# EAGLE design bristol_longshot (EAGLE 7.3.0)
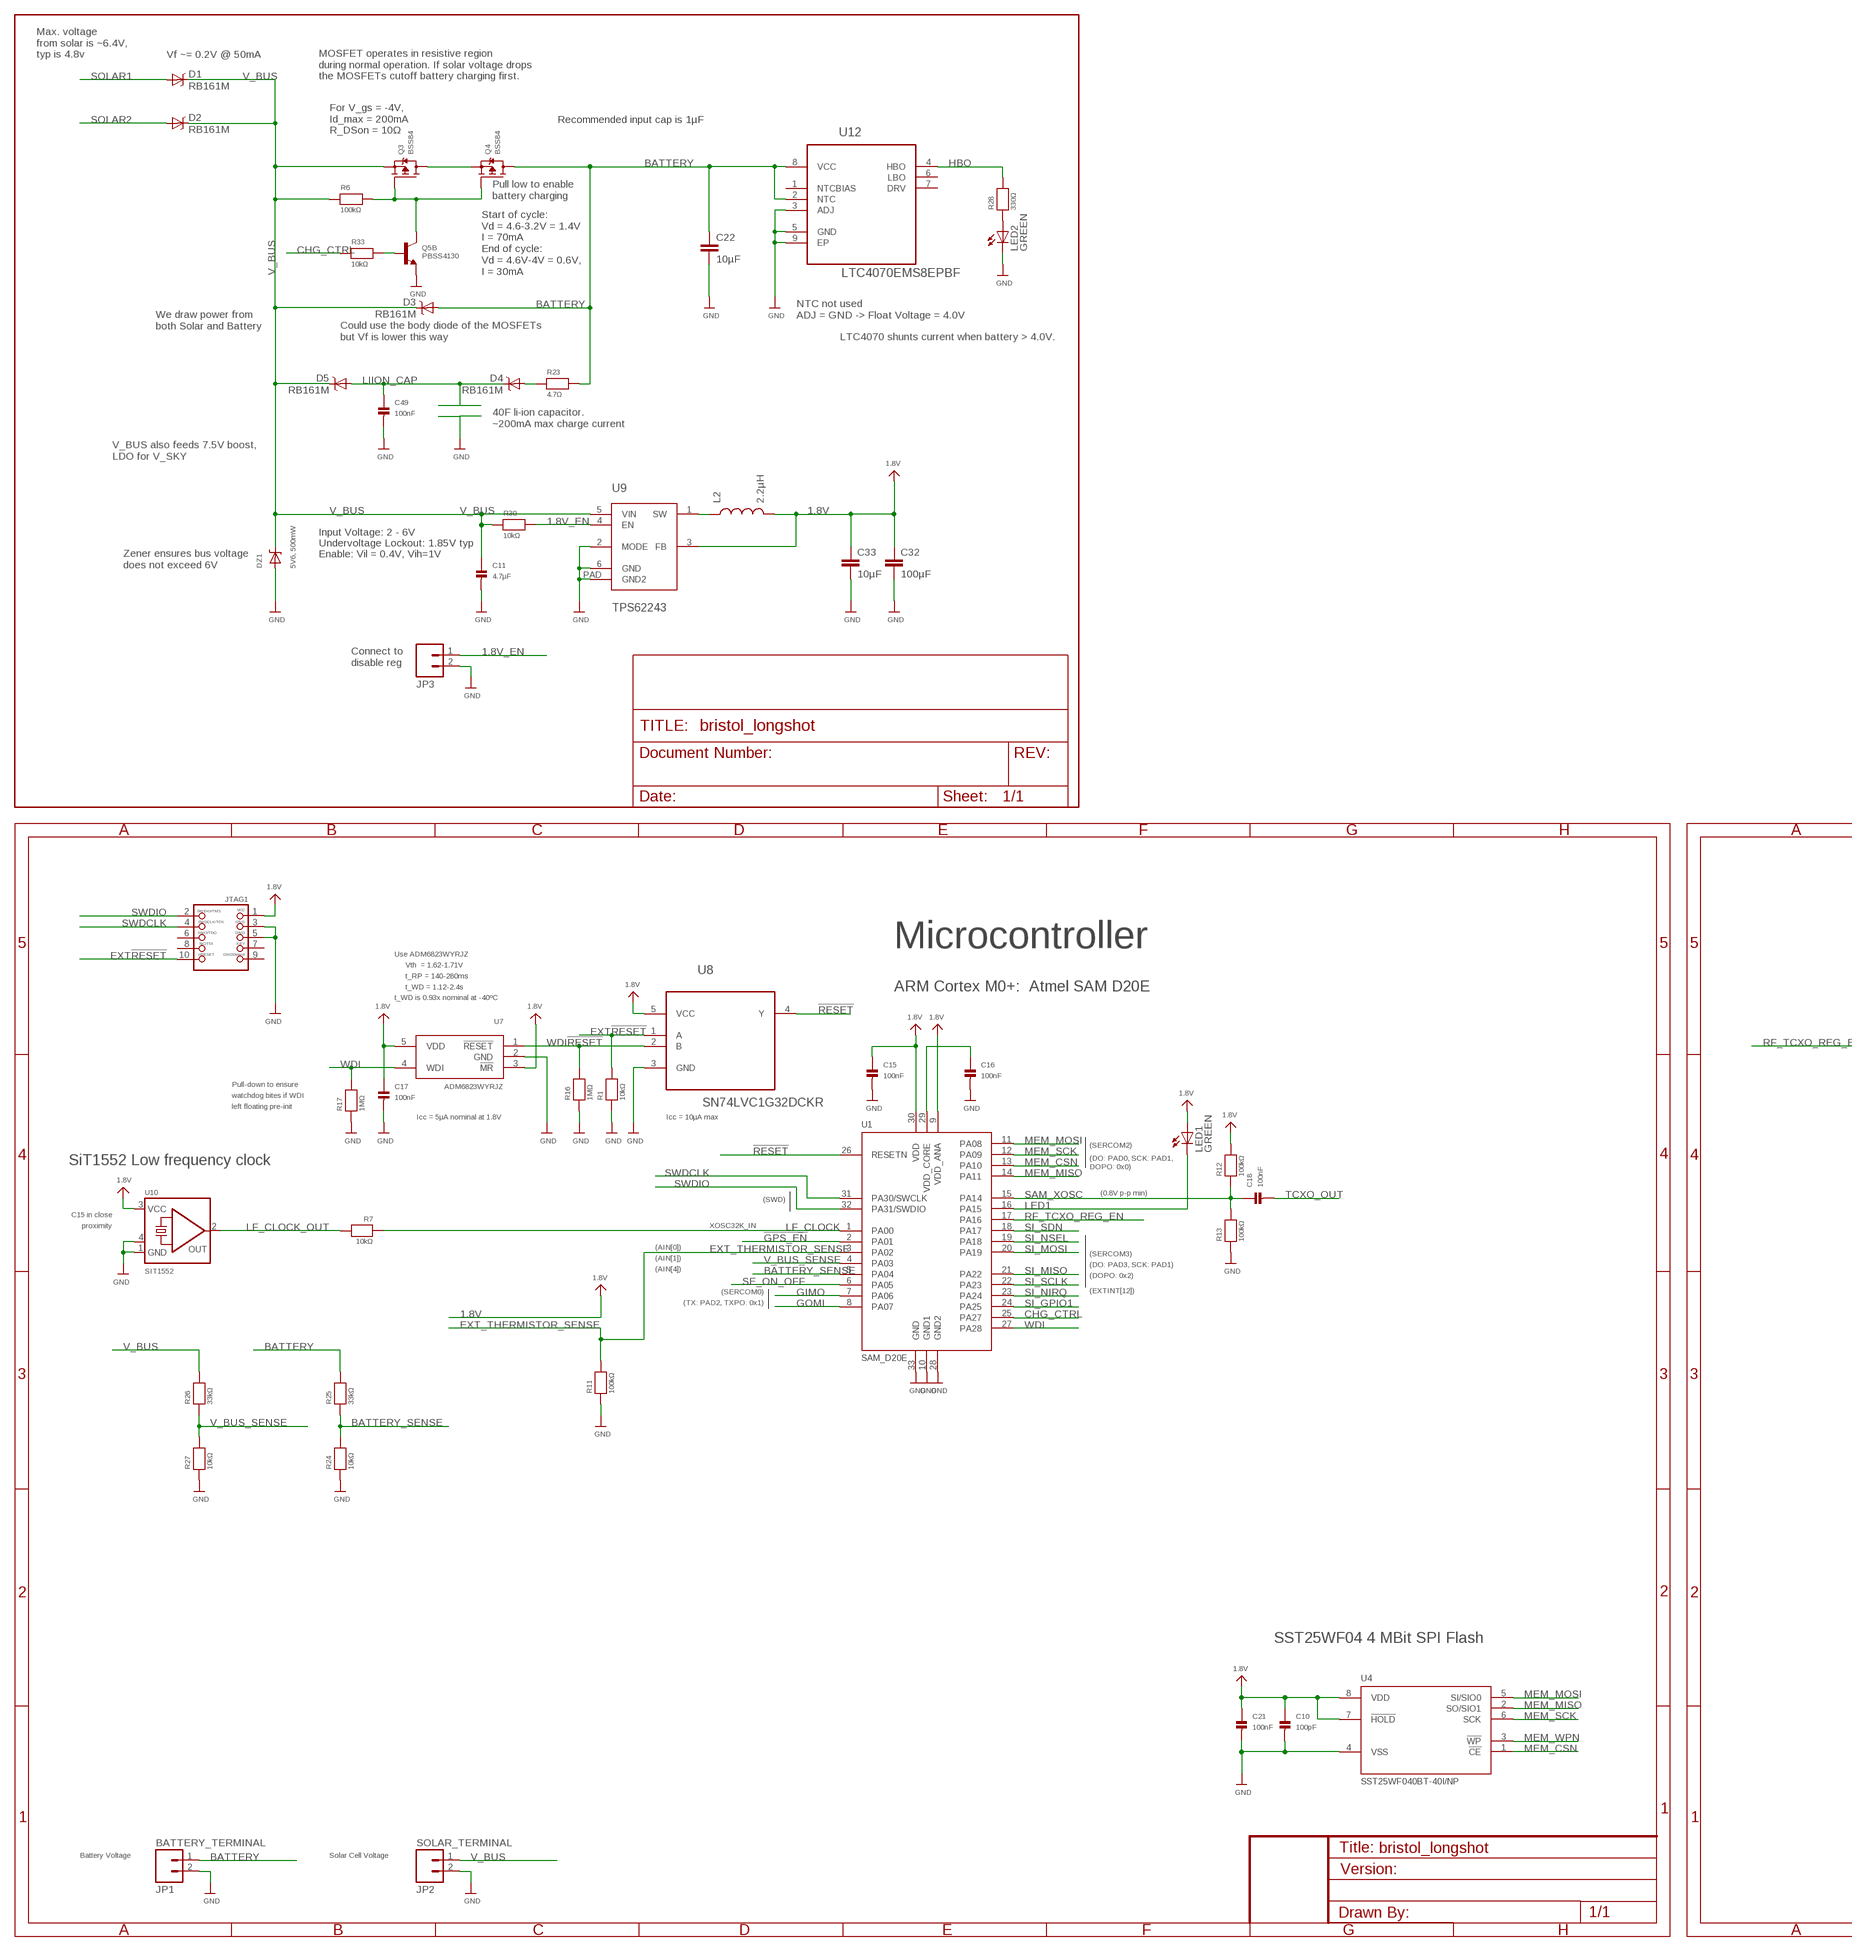
[diagram p0: schematic, sheet 1, part 1 of 3]
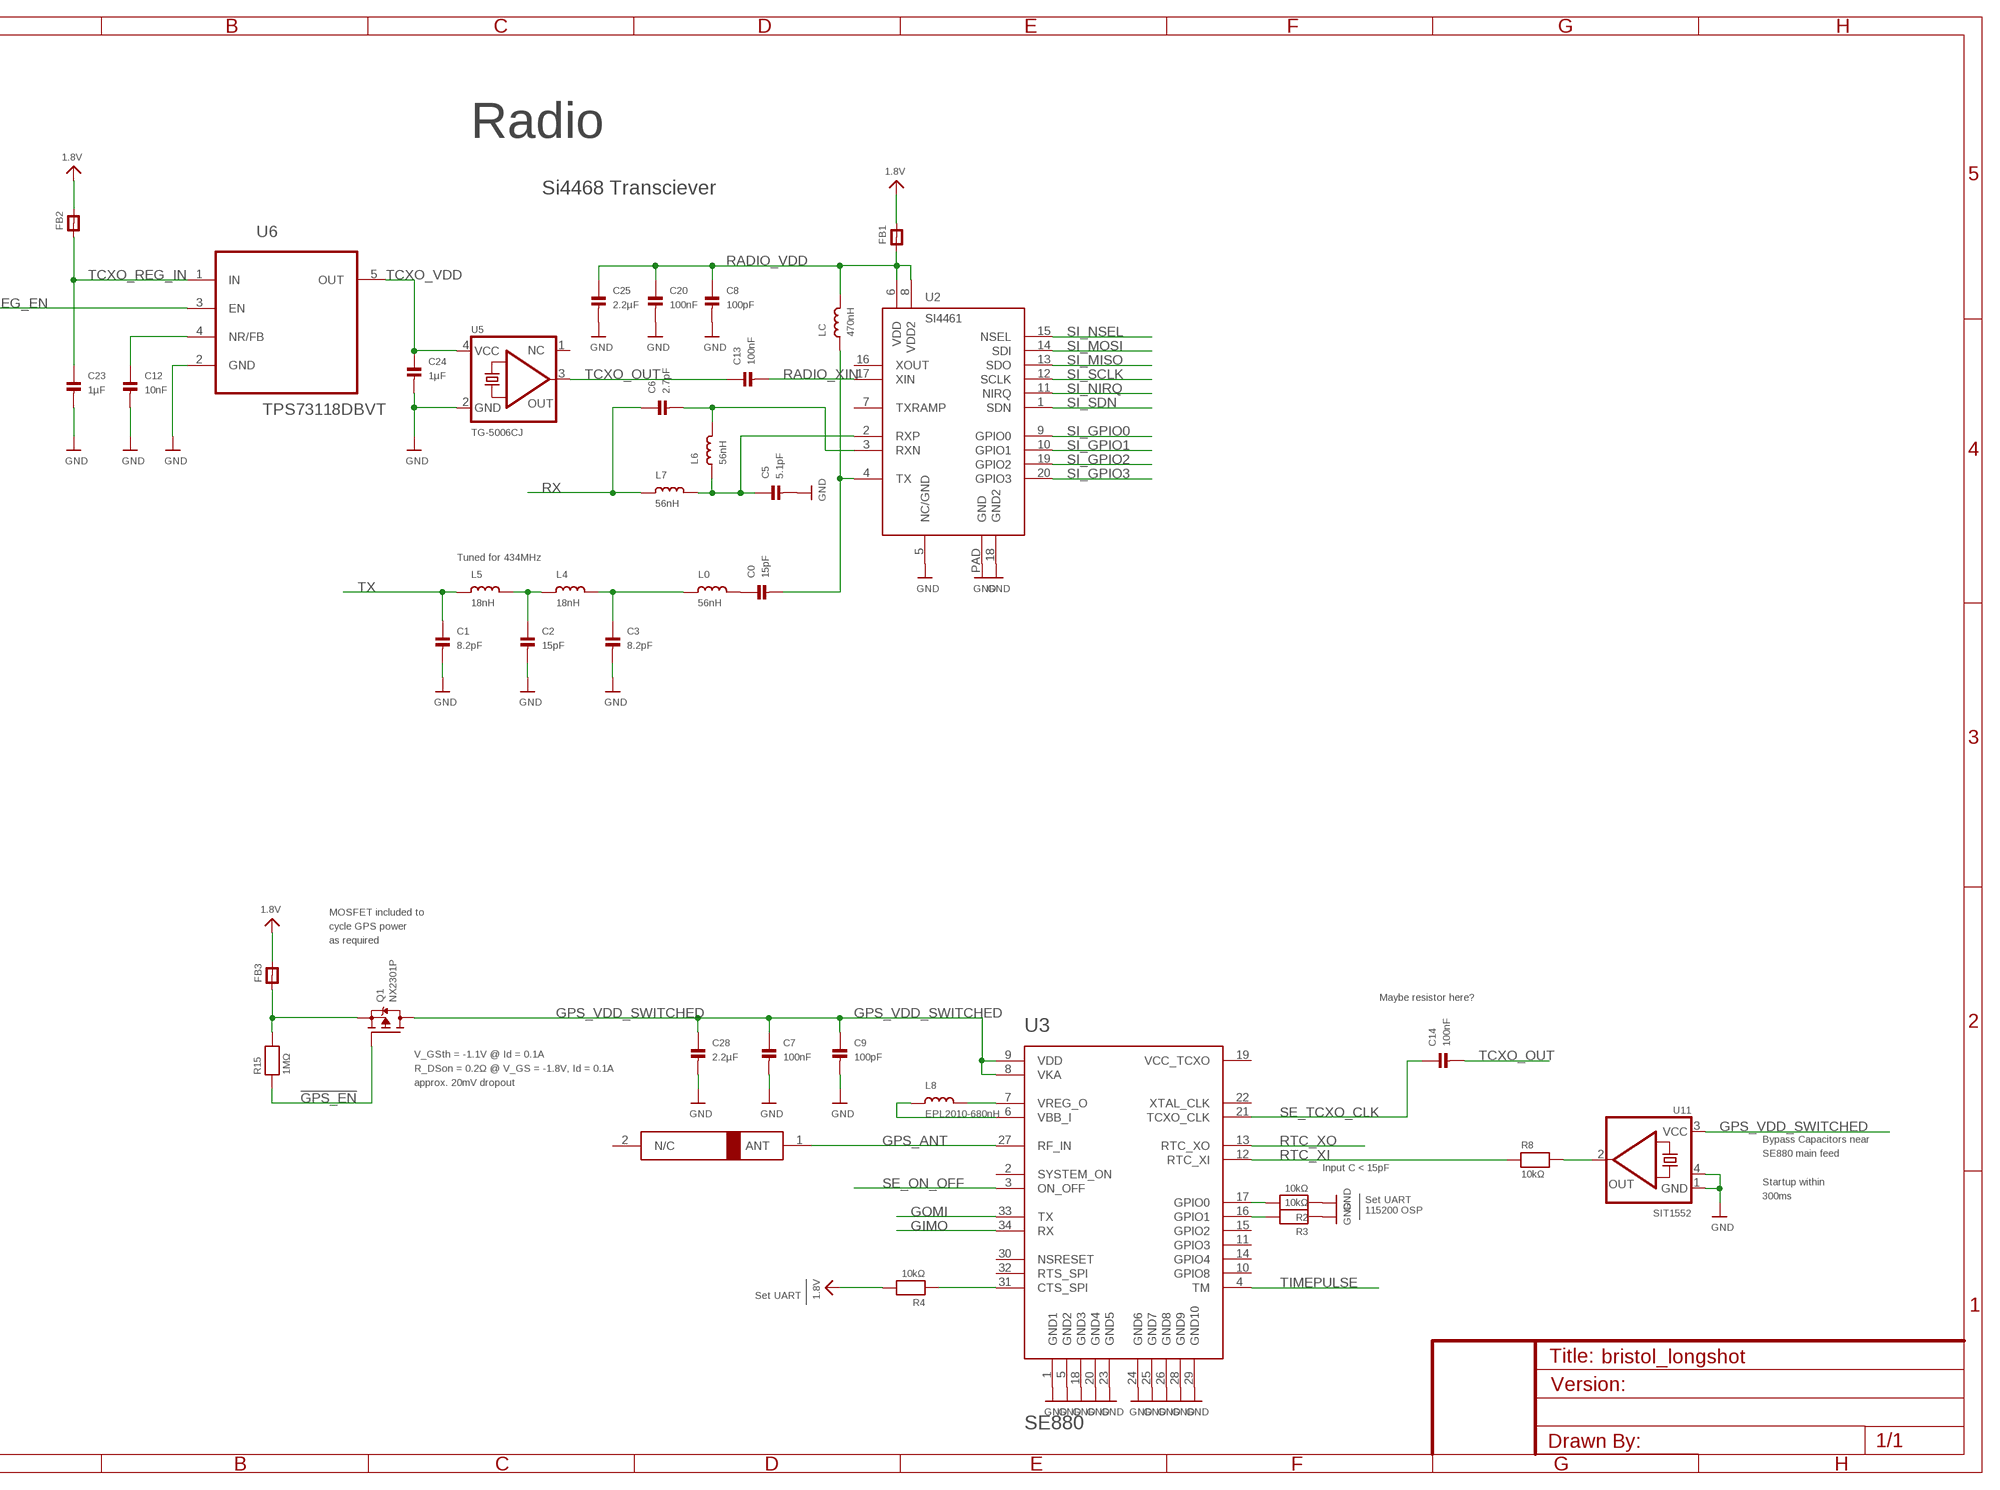
[diagram p1: schematic, sheet 1, part 2 of 3]
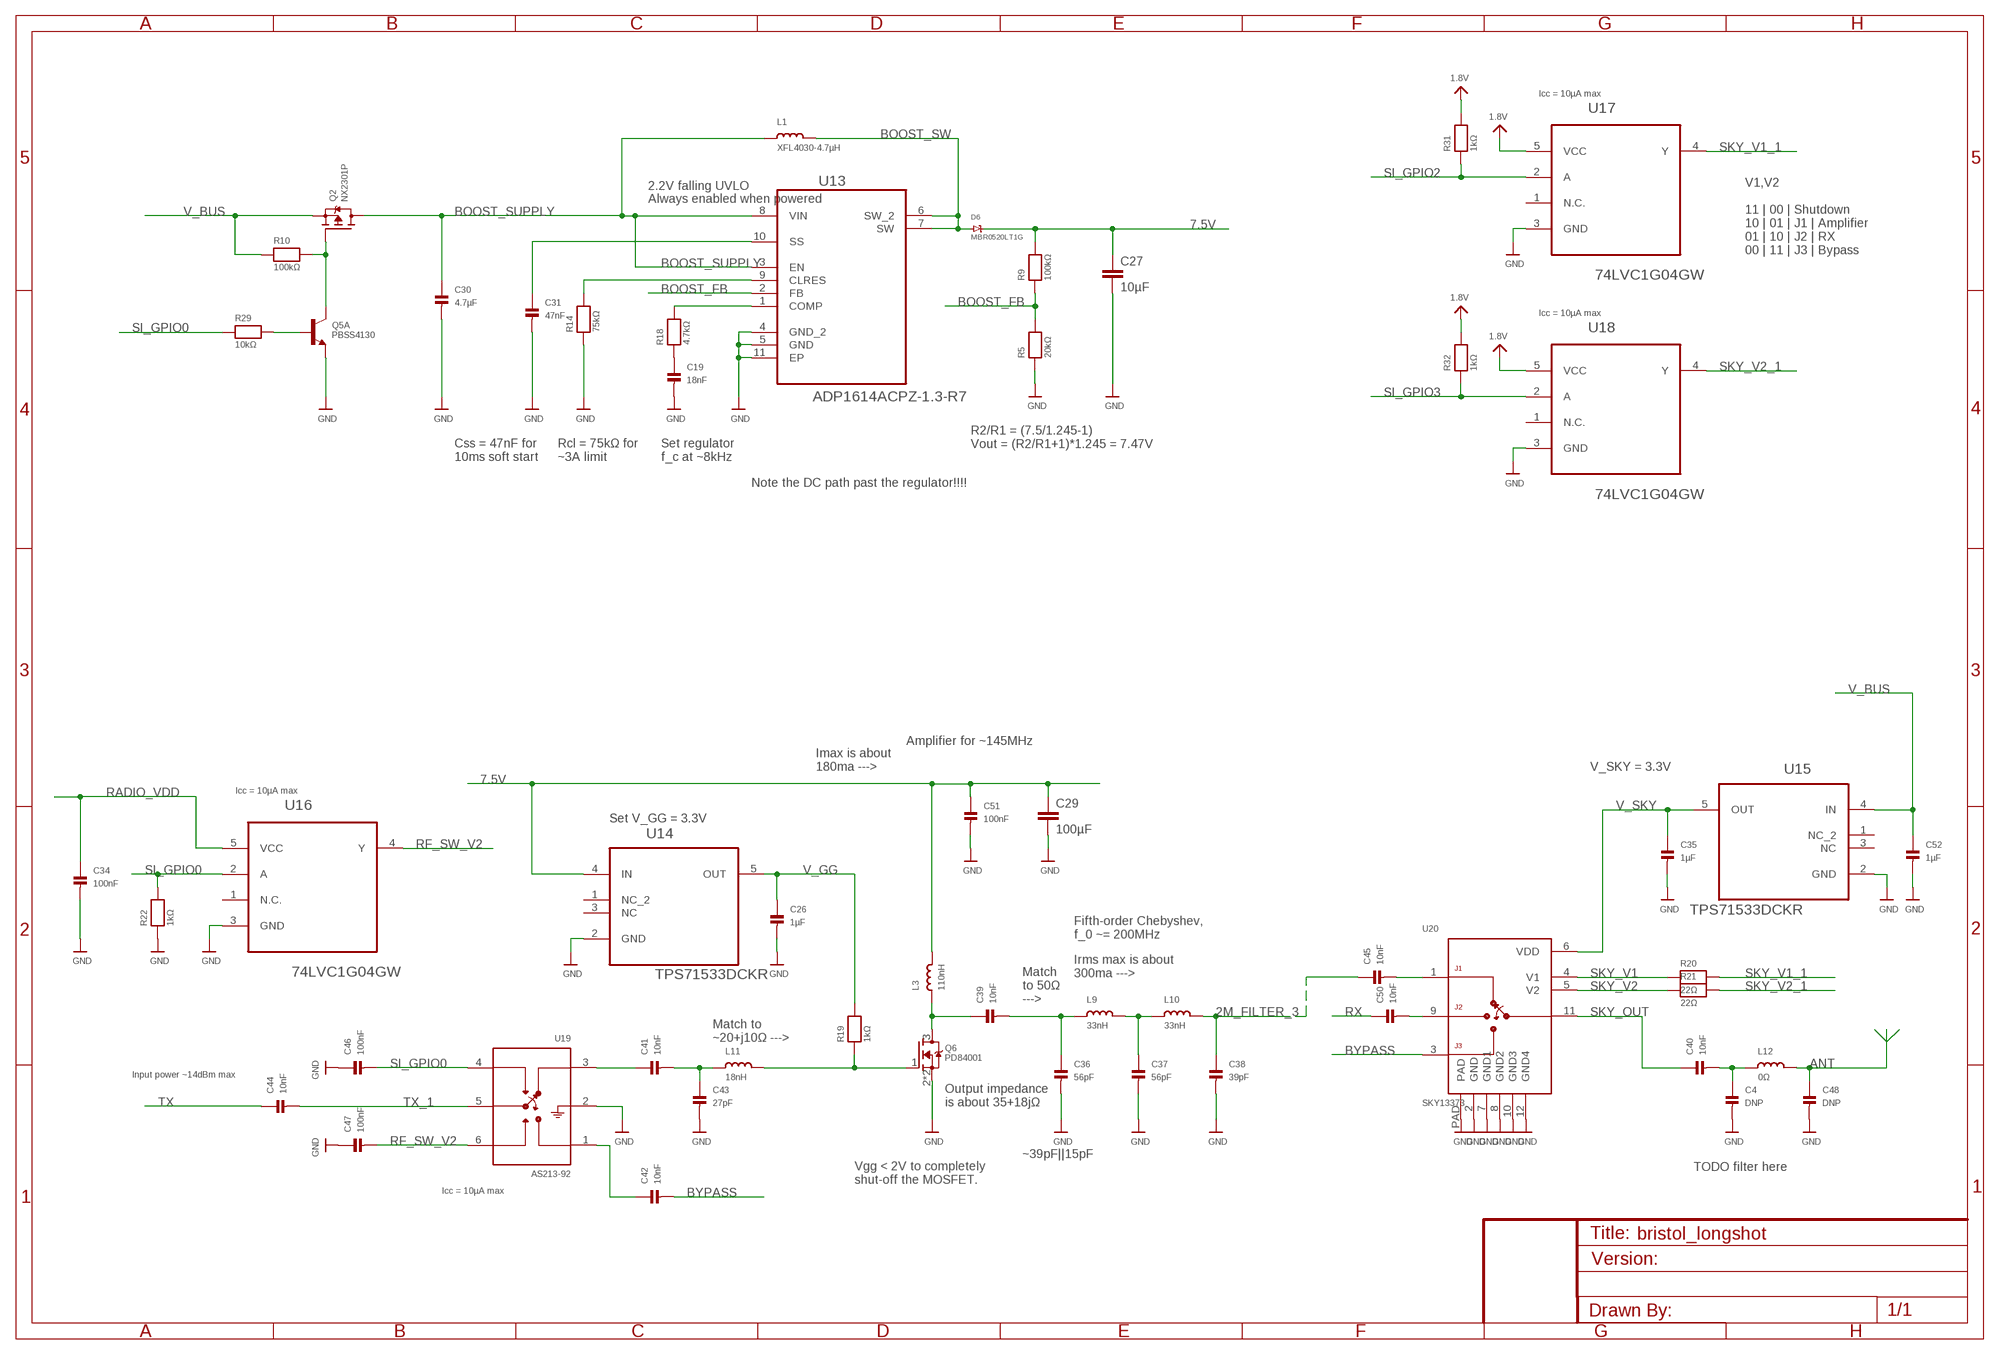
[diagram p2: schematic, sheet 1, part 3 of 3]

## Parts
A1  1575AT43A40  [1575AT43A40]
C0  15pF  CAP_CERAMIC_0402  [_0402]
C1  8.2pF  CAP_CERAMIC_0402  [_0402]
C2  15pF  CAP_CERAMIC_0402  [_0402]
C3  8.2pF  CAP_CERAMIC_0402  [_0402]
C4  DNP  CAP_CERAMIC_0402  [_0402]
C5  5.1pF  CAP_CERAMIC_0402  [_0402]
C6  2.7pF  CAP_CERAMIC_0402  [_0402]
C7  100nF  CAP_CERAMIC_0402  [_0402]
C8  100pF  CAP_CERAMIC_0402  [_0402]
C9  100pF  CAP_CERAMIC_0402  [_0402]
C10  100pF  CAP_CERAMIC_0402  [_0402]
C11  4.7µF  CAP_CERAMIC_0402  [_0402]
C12  10nF  CAP_CERAMIC_0402  [_0402]
C13  100nF  CAP_CERAMIC_0402  [_0402]
C14  100nF  CAP_CERAMIC_0402  [_0402]
C15  100nF  CAP_CERAMIC_0402  [_0402]
C16  100nF  CAP_CERAMIC_0402  [_0402]
C17  100nF  CAP_CERAMIC_0402  [_0402]
C18  100nF  CAP_CERAMIC_0402  [_0402]
C19  18nF  CAP_CERAMIC_0402  [_0402]
C20  100nF  CAP_CERAMIC_0402  [_0402]
C21  100nF  CAP_CERAMIC_0402  [_0402]
C22  10µF  C-EUC0603K  [C0603K]
C23  1µF  CAP_CERAMIC_0402  [_0402]
C24  1µF  CAP_CERAMIC_0402  [_0402]
C25  2.2µF  CAP_CERAMIC_0402  [_0402]
C26  1µF  CAP_CERAMIC_0402  [_0402]
C27  10µF  C-EUC0603K  [C0603K]
C28  2.2µF  CAP_CERAMIC_0402  [_0402]
C29  100µF  C-EUC1206K  [C1206K]
C30  4.7µF  CAP_CERAMIC_0402  [_0402]
C31  47nF  CAP_CERAMIC_0402  [_0402]
C32  100µF  C-EUC1206K  [C1206K]
C33  10µF  C-EUC0603K  [C0603K]
C34  100nF  CAP_CERAMIC_0402  [_0402]
C35  1µF  CAP_CERAMIC_0402  [_0402]
C36  56pF  CAP_CERAMIC_0402  [_0402]
C37  56pF  CAP_CERAMIC_0402  [_0402]
C38  39pF  CAP_CERAMIC_0402  [_0402]
C39  10nF  CAP_CERAMIC_0402  [_0402]
C40  10nF  CAP_CERAMIC_0402  [_0402]
C41  10nF  CAP_CERAMIC_0402  [_0402]
C42  10nF  CAP_CERAMIC_0402  [_0402]
C43  27pF  CAP_CERAMIC_0402  [_0402]
C44  10nF  CAP_CERAMIC_0402  [_0402]
C45  10nF  CAP_CERAMIC_0402  [_0402]
C46  100nF  CAP_CERAMIC_0402  [_0402]
C47  100nF  CAP_CERAMIC_0402  [_0402]
C48  DNP  CAP_CERAMIC_0402  [_0402]
C49  100nF  CAP_CERAMIC_0402  [_0402]
C50  10nF  CAP_CERAMIC_0805  [_0805]
C51  100nF  CAP_CERAMIC_0402  [_0402]
C52  1µF  CAP_CERAMIC_0402  [_0402]
D1  RB161M  [RB161M]
D2  RB161M  [RB161M]
D3  RB161M  [RB161M]
D4  RB161M  [RB161M]
D5  RB161M  [RB161M]
D6  MBR0520LT1G  DIODE[SCHOTKY]-SOD123W  [SOD123W]
DZ1  5V6, 500mW  DIODE-ZENERSOD  [SOD-323]
FB1  FERRITE_0402  [_0402]
FB2  FERRITE_0402  [_0402]
FB3  FERRITE_0603  [_0603]
JP1  BATTERY_TERMINAL  M02LOCK  [1X02_LOCK]
JP2  SOLAR_TERMINAL  M02LOCK  [1X02_LOCK]
JP3  M02LOCK  [1X02_LOCK]
JTAG1  JTAG-CORTEXM3SMT  [2X05_1.27MM_SMT]
L0  56nH  INDUCTOR_0402  [_0402@2]
L1  XFL4030-4.7µH  XFL4020  [XFL4020]
L2  2.2µH  INDUCTOR1007  [1007]
L3  110nH  INDUCTOR_0805MP  [_0805MP]
L4  18nH  INDUCTOR_0402  [_0402@2]
L5  18nH  INDUCTOR_0402  [_0402@2]
L6  56nH  INDUCTOR_0402  [_0402@2]
L7  56nH  INDUCTOR_0402  [_0402@2]
L8  EPL2010-680nH  EPL2010  [EPL2010]
L9  33nH  INDUCTOR_0603MP  [_0603MP]
L10  33nH  INDUCTOR_0603MP  [_0603MP]
L11  18nH  INDUCTOR_0402  [_0402@2]
L12  0Ω  INDUCTOR_0402  [_0402@2]
LC  470nH  INDUCTOR_0402  [_0402@2]
LED1  GREEN  LEDCHIPLED_0603  [CHIPLED_0603]
LED2  GREEN  LEDCHIPLED_0603  [CHIPLED_0603]
Q1  NX2301P  [SOT23]
Q2  NX2301P  [SOT23]
Q3  BSS84  NX2301P  [SOT23]
Q4  BSS84  NX2301P  [SOT23]
Q5  PBSS4130  [SOT1118]
Q6  PD84001  [SOT-89]
R1  10kΩ  RESISTOR_0402  [_0402]
R2  10kΩ  RESISTOR_0402  [_0402]
R3  10kΩ  RESISTOR_0402  [_0402]
R4  10kΩ  RESISTOR_0402  [_0402]
R5  20kΩ  RESISTOR_0402  [_0402]
R6  100kΩ  RESISTOR_0402  [_0402]
R7  10kΩ  RESISTOR_0402  [_0402]
R8  10kΩ  RESISTOR_0402  [_0402]
R9  100kΩ  RESISTOR_0402  [_0402]
R10  100kΩ  RESISTOR_0402  [_0402]
R11  100kΩ  RESISTOR_0402  [_0402]
R12  100kΩ  RESISTOR_0402  [_0402]
R13  100kΩ  RESISTOR_0402  [_0402]
R14  75kΩ  RESISTOR_0402  [_0402]
R15  1MΩ  RESISTOR_0402  [_0402]
R16  1MΩ  RESISTOR_0402  [_0402]
R17  1MΩ  RESISTOR_0402  [_0402]
R18  4.7kΩ  RESISTOR_0402  [_0402]
R19  1kΩ  RESISTOR_0402  [_0402]
R20  22Ω  RESISTOR_0603MP  [_0603MP]
R21  22Ω  RESISTOR_0603MP  [_0603MP]
R22  1kΩ  RESISTOR_0402  [_0402]
R23  4.7Ω  RESISTOR_0402  [_0402]
R24  10kΩ  RESISTOR_0402  [_0402]
R25  33kΩ  RESISTOR_0402  [_0402]
R26  33kΩ  RESISTOR_0402  [_0402]
R27  10kΩ  RESISTOR_0402  [_0402]
R28  330Ω  RESISTOR_0402  [_0402]
R29  10kΩ  RESISTOR_0402  [_0402]
R30  10kΩ  RESISTOR_0402  [_0402]
R31  1kΩ  RESISTOR_0402  [_0402]
R32  1kΩ  RESISTOR_0402  [_0402]
R33  10kΩ  RESISTOR_0402  [_0402]
U1  SAM_D20E  [QFN32_5MM]
U2  SI4461  SI4060  [QFN20]
U3  SE880  [SE880]
U4  SST25WF040BT-40I/NP  [USON-8]
U5  TG-5006CJ  [TC-5006CJ]
U6  TPS73118DBVT  [SOT95P280X145-5N]
U7  ADM6823WYRJZ  TPS3123  [SOT23-5]
U8  SN74LVC1G32DCKR  [SOT65P210X110-5N]
U9  TPS62243  [S-PWSON-N6]
U10  SIT1552  [SIT1552]
U11  SIT1552  [SIT1552]
U12  LTC4070EMS8EPBF  [SOP65P490X110-9N]
U13  ADP1614ACPZ-1.3-R7  [DFN50P300X300X80-11N]
U14  TPS71533DCKR  [SOT65P210X110-5N]
U15  TPS71533DCKR  [SOT65P210X110-5N]
U16  74LVC1G04GW  [SOT65P210X110-5N]
U17  74LVC1G04GW  [SOT65P210X110-5N]
U18  74LVC1G04GW  [SOT65P210X110-5N]
U19  AS213-92  [SOT-6]
U20  SKY13373  [SKY13373]

## Nets
1.8V: C10.1 C15.1 C17.1 C21.1 C32.1 C33.1 FB1.2 FB2.2 FB3.2 JTAG1.1 L2.2 LED1.A R4.2 R12.2 R31.2 R32.2 U1.9(VDD_ANA) U1.30(VDD) U4.7(!HOLD) U4.8(VDD) U7.3(!MR) U7.5(VDD) U8.5(VCC) U9.3(FB) U10.3(VCC) U17.5(VCC) U18.5(VCC)
1.8V_EN: JP3.1 R30.2 U9.4(EN)
2M_FILTER_1: C36.1 C39.2 L9.1
2M_FILTER_2: C37.1 L9.2 L10.1
2M_FILTER_3: C38.1 C45.1 L10.2
7.5V: C27.1 C29.1 C51.1 D6.P$2 L3.2 R9.2 U14.4(IN)
!GPS_EN: Q1.1(G) R15.1 U1.2(PA01)
!RESET: U1.26(RESETN) U8.4(Y)
AMPL_DRAIN: C39.1 L3.1 Q6.3(D)
AMPL_GATE: L11.2 Q6.1(G) R19.1
AMPL_IN: C41.2 C43.1 L11.1
AMPL_IN1: C41.1 U19.3(J2)
AMPL_OUT: C45.2 U20.1(J1)
ANT: C48.1 L12.2
ANT1: C4.1 C40.2 L12.1
BATTERY: C22.1 D3.ANODE(A) JP1.1 Q4.3(D) R23.2 R25.2 U12.2(NTC) U12.8(VCC)
BATTERY_MOSFET_1: Q3.3(D) Q4.2(S)
BATTERY_SENSE: R24.2 R25.1 U1.5(PA04)
BOOST_COMP: R18.2 U13.1(COMP)
BOOST_COMP_1: C19.1 R18.1
BOOST_CURRENTLIMIT: R14.2 U13.9(CLRES)
BOOST_FB: R5.2 R9.1 U13.2(FB)
BOOST_SOFTSTART: C31.1 U13.10(SS)
BOOST_SUPPLY: C30.1 L1.1 Q2.3(D) U13.3(EN) U13.8(VIN)
BOOST_SUPPLY_CTRL_B: Q5.P2(A:B) R29.2
BOOST_SUPPLY_CTRL_C: Q2.1(G) Q5.P3(A:C) Q5.P8(A:C) R10.2
BOOST_SW: D6.P$1 L1.2 U13.6(SW_2) U13.7(SW)
BUCK_SW: L2.1 U9.1(SW)
BYPASS: C42.2 U20.3(J3)
BYPASS1: C42.1 U19.1(J3)
CHG_CTRL: R33.1 U1.25(PA27)
CHG_CTRL_B: Q5.P5(B:B) R33.2
CHG_CTRL_C: Q3.1(G) Q4.1(G) Q5.P6(B:C) Q5.P7(B:C) R6.2
CHG_LED: LED2.A R28.1
EXT!RESET: JTAG1.10 R1.2 U8.1(A)
EXT_THERMISTOR_SENSE: R11.2 U1.3(PA02)
FILTER1: C3.1 L0.1 L4.2
FILTER2: C2.1 L4.1 L5.2
GIMO: U1.7(PA06) U3.34(RX)
GND: C1.2 C2.2 C3.2 C4.2 C5.2 C7.2 C8.2 C9.2 C10.2 C11.2 C12.2 C15.2 C16.2 C17.2 C19.2 C20.2 C21.2 C22.2 C23.2 C24.2 C25.2 C26.2 C27.2 C28.2 C29.2 C30.2 C31.2 C32.2 C33.2 C34.2 C35.2 C36.2 C37.2 C38.2 C43.2 C46.1 C47.1 C48.2 C49.2 C51.2 C52.2 DZ1.A JP1.2 JP2.2 JP3.2 JTAG1.3 JTAG1.5 LED2.C Q5.P1(A:E) Q5.P4(B:E) Q6.2(S) Q6.2.1(S) R1.1 R2.1 R3.1 R5.1 R11.1 R13.1 R14.1 R16.1 R17.1 R22.1 R24.1 R27.1 U1.10(GND1) U1.28(GND2) U1.33(GND) U2.5(NC/GND) U2.18(GND2) U2.PAD(GND) U3.1(GND1) U3.5(GND2) U3.18(GND3) U3.20(GND4) U3.23(GND5) U3.24(GND6) U3.25(GND7) U3.26(GND8) U3.28(GND9) U3.29(GND10) U4.4(VSS) U5.2(GND) U6.2(GND) U7.2(GND) U8.3(GND) U9.2(MODE) U9.6(GND) U9.PAD(GND2) U10.1(GND) U10.4(GND1) U11.1(GND) U11.4(GND1) U12.3(ADJ) U12.5(GND) U12.9(EP) U13.4(GND_2) U13.5(GND) U13.11(EP) U14.2(GND) U15.2(GND) U16.3(GND) U17.3(GND) U18.3(GND) U19.2(GND) U20.2(GND) U20.7(GND1) U20.8(GND2) U20.10(GND3) U20.12(GND4) U20.PAD
GOMI: U1.8(PA07) U3.33(TX)
GPS_ANT: A1.1(ANT) U3.27(RF_IN)
GPS_VDD: FB3.1 Q1.2(S) R15.2
GPS_VDD_SWITCHED: C7.1 C9.1 C28.1 Q1.3(D) U3.8(VKA) U3.9(VDD) U11.3(VCC)
HBO: R28.2 U12.4(HBO)
LED1: LED1.C U1.16(PA15)
LF_CLOCK: R7.1 U1.1(PA00)
LF_CLOCK_OUT: R7.2 U10.2(OUT)
LIION_CAP: C49.1 D4.CATHODE(C) D5.ANODE(A)
LIION_CAP_FEED: D4.ANODE(A) R23.1
MEM_CSN: U1.13(PA10) U4.1(!CE)
MEM_MISO: U1.14(PA11) U4.2(SO/SIO1)
MEM_MOSI: U1.11(PA08) U4.5(SI/SIO0)
MEM_SCK: U1.12(PA09) U4.6(SCK)
MEM_WPN: U4.3(!WP)
RADIO_VDD: C8.1 C20.1 C25.1 C34.1 FB1.1 LC.2 U2.6(VDD) U2.8(VDD2) U16.5(VCC)
RADIO_XIN: C13.2 U2.17(XIN)
RF_SW_V2: C47.2 U16.4(Y) U19.6(V2)
RF_TANK: C0.1 L0.2
RF_TCXO_REG_EN: U1.17(PA16) U6.3(EN)
RTC_XI: R8.1 U3.12(RTC_XI)
RTC_XO: U3.13(RTC_XO)
RX: C6.1 C50.1 L7.1
RX_1: C50.2 U20.9(J2)
RXN: C5.1 L6.1 L7.2 U2.2(RXP)
RXP: C6.2 L6.2 U2.3(RXN)
SAM_XOSC: C18.1 R12.1 R13.2 U1.15(PA14)
SE800_LF_OUT: R8.2 U11.2(OUT)
SE_GPIO0: R2.2 U3.17(GPIO0)
SE_GPIO1: R3.2 U3.16(GPIO1)
SE_MODE_PULL: R4.1 U3.31(CTS_SPI)
SE_ON_OFF: U1.6(PA05) U3.3(ON_OFF)
SE_TCXO_CLK: C14.1 U3.21(TCXO_CLK)
SE_VBB: L8.1 U3.6(VBB_I)
SE_VREG: L8.2 U3.7(VREG_O)
SI_GPIO0: C46.2 R22.2 R29.1 U2.9(GPIO0) U16.2(A) U19.4(V1)
SI_GPIO1: U1.24(PA25) U2.10(GPIO1)
SI_GPIO2: R31.1 U2.19(GPIO2) U17.2(A)
SI_GPIO3: R32.1 U2.20(GPIO3) U18.2(A)
SI_MISO: U1.21(PA22) U2.13(SDO)
SI_MOSI: U1.20(PA19) U2.14(SDI)
SI_NIRQ: U1.23(PA24) U2.11(NIRQ)
SI_NSEL: U1.19(PA18) U2.15(NSEL)
SI_SCLK: U1.22(PA23) U2.12(SCLK)
SI_SDN: U1.18(PA17) U2.1(SDN)
SI_TX: C0.2 LC.1 U2.4(TX)
SKY_OUT: C40.1 U20.11(RFC)
SKY_V1: R20.1 U20.4(V1)
SKY_V1_1: R20.2 U17.4(Y)
SKY_V2: R21.1 U20.5(V2)
SKY_V2_1: R21.2 U18.4(Y)
SOLAR1: D1.ANODE(A)
SOLAR2: D2.ANODE(A)
SWDCLK: JTAG1.4 U1.31(PA30/SWCLK)
SWDIO: JTAG1.2 U1.32(PA31/SWDIO)
TCXO_OUT: C13.1 C14.2 C18.2 U5.3(OUT)
TCXO_REG_IN: C23.1 FB2.1 U6.1(IN)
TCXO_REG_NR: C12.1 U6.4(NR/FB)
TCXO_VDD: C24.1 U5.4(VCC) U6.5(OUT)
TIMEPULSE: U3.4(TM)
TX: C1.1 C44.1 L5.1
TX_1: C44.2 U19.5(J1)
V_BUS: C11.1 C52.1 D1.CATHODE(C) D2.CATHODE(C) D3.CATHODE(C) D5.CATHODE(C) DZ1.C JP2.1 Q2.2(S) Q3.2(S) R6.1 R10.1 R26.2 R30.1 U9.5(VIN) U15.4(IN)
V_BUS_SENSE: R26.1 R27.2 U1.4(PA03)
V_GG: C26.1 R19.2 U14.5(OUT)
V_SKY: C35.1 U15.5(OUT) U20.6(VDD)
VDD_CORE: C16.1 U1.29(VDD_CORE)
WDI: R17.2 U1.27(PA28) U7.4(WDI)
WDI!RESET: R16.2 U7.1(!RESET) U8.2(B)
Unconnected: A1.2(N/C) JTAG1.6 JTAG1.7 JTAG1.8 JTAG1.9 U2.7(TXRAMP) U2.16(XOUT) U3.2(SYSTEM_ON) U3.10(GPIO8) U3.11(GPIO3) U3.14(GPIO4) U3.15(GPIO2) U3.19(VCC_TCXO) U3.22(XTAL_CLK) U3.30(NSRESET) U3.32(RTS_SPI) U5.1(NC) U12.6(LBO) U12.7(DRV) U14.1(NC_2) U14.3(NC) U15.1(NC_2) U15.3(NC) U16.1(N.C.) U17.1(N.C.) U18.1(N.C.)

## Notes on the sheet
- Max. voltage
  from solar is ~6.4V,
  typ is 4.8v
- Vf ~= 0.2V @ 50mA
- MOSFET operates in resistive region
  during normal operation. If solar voltage drops
  the MOSFETs cutoff battery charging first.
- Recommended input cap is 1µF
- For V_gs = -4V,
  Id_max = 200mA
  R_DSon = 10Ω
- Pull low to enable
  battery charging
- Start of cycle:
  Vd = 4.6-3.2V = 1.4V
  I = 70mA
  End of cycle: 
  Vd = 4.6V-4V = 0.6V, 
  I = 30mA
- NTC not used
  ADJ = GND -> Float Voltage = 4.0V
- We draw power from
  both Solar and Battery
- Could use the body diode of the MOSFETs
  but Vf is lower this way
- LTC4070 shunts current when battery > 4.0V.
- 40F li-ion capacitor.
  ~200mA max charge current
- V_BUS also feeds 7.5V boost,
  LDO for V_SKY
- Input Voltage: 2 - 6V
- Undervoltage Lockout: 1.85V typ
- Enable: Vil = 0.4V, Vih=1V
- Zener ensures bus voltage
  does not exceed 6V
- Connect to
  disable reg
- Icc = 10µA max
- Radio
- Microcontroller
- Use ADM6823WYRJZ
- Si4468 Transciever
- 2.2V falling UVLO
- Always enabled when powered
- Vth  = 1.62-1.71V
  t_RP = 140-280ms
  t_WD = 1.12-2.4s
- ARM Cortex M0+:  Atmel SAM D20E
- t_WD is 0.93x nominal at -40ºC
- V1,V2
  
  11 | 00 | Shutdown
  10 | 01 | J1 | Amplifier
  01 | 10 | J2 | RX
  00 | 11 | J3 | Bypass
- Icc = 10µA max
- Pull-down to ensure
  watchdog bites if WDI
  left floating pre-init
- Icc = 5µA nominal at 1.8V | Icc = 10µA max
- (SERCOM2)
- (DO: PAD0, SCK: PAD1,
  DOPO: 0x0)
- SiT1552 Low frequency clock
- R2/R1 = (7.5/1.245-1)
  Vout = (R2/R1+1)*1.245 = 7.47V
- (0.8V p-p min)
- Css = 47nF for
  10ms soft start
- Rcl = 75kΩ for
  ~3A limit
- Set regulator
  f_c at ~8kHz
- (SWD)
- Note the DC path past the regulator!!!!
- C15 in close
  proximity
- XOSC32K_IN
- Tuned for 434MHz
- (AIN[0])
- (SERCOM3)
- (AIN[1])
- (DO: PAD3, SCK: PAD1)
- (AIN[4])
- (DOPO: 0x2)
- (SERCOM0) | (EXTINT[12])
- (TX: PAD2, TXPO: 0x1)
- Amplifier for ~145MHz
- Imax is about
  180ma --->
- V_SKY = 3.3V
- Icc = 10µA max
- Set V_GG = 3.3V
- MOSFET included to
  cycle GPS power
  as required
- Maybe resistor here?
- Fifth-order Chebyshev,
  f_0 ~= 200MHz
- V_GSth = -1.1V @ Id = 0.1A
- R_DSon = 0.2Ω @ V_GS = -1.8V, Id = 0.1A
- Irms max is about
  300ma --->
- SST25WF04 4 MBit SPI Flash | approx. 20mV dropout
- Match
  to 50Ω
  --->
- Match to 
  ~20+j10Ω --->
- Bypass Capacitors near
  SE880 main feed
- Input C < 15pF
- Input power ~14dBm max
- Startup within
  300ms
- Set UART
  115200 OSP
- Output impedance
  is about 35+18jΩ
- ~39pF||15pF
- TODO filter here
- Set UART
- Vgg < 2V to completely
  shut-off the MOSFET.
- Icc = 10µA max
- Battery Voltage | Solar Cell Voltage

## Power pins joined to a net without a drawn wire
NTCBIAS: U12.1(NTCBIAS)

## Library data of the parts
A1 = 1575AT43A40:1575AT43A40
C0 C1-C21 C23-C26 C28 C30 C31 C34-C52 = microbuilder_v3:CAP_CERAMIC: Ceramic Capacitors 0402 - 0402 Surface Mount Capacitors 16pF 50V 5% [Digikey: 445-4899-2-ND] 18pF 50V 5% [Digikey: 490-1281-2-ND] 22pF 50V 5% [Digikey: 490-1283-2-ND] 68pF 50V 5% [Digikey: 490-1289-2-ND] 0.1uF 10V 10% [Digikey: 490-1318-2-ND] 1.0uF 6.3V 10% [Digikey: 490-1320-2-ND] 0603 - 0603 Surface Mount Capacitors 16 pF 50V 5% [Digikey: 445-5051-2-ND] 22 pF 50V [Digikey: PCC220ACVTR-ND] 33 pF 50V 5% [Digikey: 490-1415-1-ND] 56pF 50V 5% [Digikey: 490-1421-1-ND] 220pF 50V 5% [Digikey: 445-1285-1-ND] 680 pF 50V 2200 pF 50V 5% C0G [Digikey: 445-1297-1-ND] 5600 pF 100V 5% X7R [Digikey: 478-3711-1-ND] 0.1 µF 25V 10% [Digikey: PCC2277TR-ND] 0.22 µF 16V 10% X7R [Digikey: 445-1318-1-ND] 1.0 µF 25V 10% [Digikey: 445-5146-2-ND] 0603 - RF Specific 3pF 250V +/-0.1pF RF [Digikey: 712-1347-1-ND] 18 pF 250V 5% [Digikey: 478-3505-1-ND or 712-1322-1-ND] 56 pF 250V 5% C0G RF [Digikey: 490-4867-1-ND] 68 pF 250V RF [Digikey: 490-4868-1-ND] 0805 - 0805 Surface Mount Capacitors 220 pF 250V 2% RF Ceramic Capacitor [Digikey: 712-1398-1-ND] 1000 pF 50V 2% NP0 Ceramic Capacitor [Digikey: 478-3760-1-ND] 0.1 µF 25V 10% Ceramic Capacitor [Digikey: PCC1828TR-ND] 1.0 µF 16V 10% Ceramic Capacitor[Digikey: 490-1691-2-ND] 10.0 µF 10V 10% Ceramic Capacitor[Digikey: 709-1228-1-ND] 10.0 uF 16V 10% Ceramic Capacitor [Digikey: 478-5165-2-ND] 47 uF 6.3V 20% Ceramic Capacitor [Digikey: 587-1779-1-ND or 399-5506-1-ND] 1206 - 1206 Surface Mount Capacitors 47uF 10V 20% Ceramic Capacitor [Digikey: 490-5528-1-ND or 399-5508-1-ND or 445-6010-1-ND] 100uF 6.3V -20%, +80% Y5V Ceramic Capacitor (Digikey: 490-4512-1-ND, Mouser: 81-GRM31CF50J107ZE1L)
C22 C27 C29 C32 C33 = resistor:C-EU: CAPACITOR, European symbol
D1-D5 = RB161M:RB161M
D6 = nxp:DIODE[SCHOTKY]
DZ1 = microbuilder_v3:DIODE-ZENER: Zener Diode SMA: 30V 1W Zener Diode, 1.2Vf - Digikey: SMAZ30-FDICT-ND
FB1-FB3 = microbuilder_v3:FERRITE: Ferrite Bead 0603 MMZ1608B121C - 120 Ohm @ 100MHz, 600mA, 0.15 Ohm DC Resistance - Digikey: 445-2164-1-ND BK1608HW121-T - 120 Ohm, 600mA Ferrite Chip - Digikey: 587-1876-2-ND 0805 HZ0805B272R-10 - 2.7K Ohm @ 100MHz, 200mA, 0.8 Ohm DC Resistance - Digikey: 240-2504-1-ND (see also Murata BLM21BD272SN1L) MMZ2012Y152B - 1.5K Ohm @ 100MHz, 500mA, 0.4 Ohm DC Resistance - Digikey: 445-1560-1-ND - Mainly for high frequency (80-400MHz) MMZ2012R102A - 1K Ohm @ 100MHz, 500mA, 0.3 Ohm DC Resistance - Digikey: 445-1555-2-ND - More general purpose (10-200MHz)
JP1-JP3 = SparkFun:M02: Header 2 Standard 2-pin 0.1" header. Use with straight break away headers (SKU : PRT-00116), right angle break away headers (PRT-00553), swiss pins (PRT-00743), machine pins (PRT-00117), and female headers (PRT-00115). Molex polarized connector foot print use with SKU : PRT-08233 with associated crimp pins and housings.
JTAG1 = microbuilder_v3:JTAG-CORTEXM3: Serial Wire (SW-DP) Connector This standard 0.05" 10-pin connector is for use with the Cortex M0/M3's native SWD (serial wire debugger) interface (SW-DP). Some boards support a 20-pin combined JTAG+SWD connector (SWJ-DP), such as the LPC1700 family, but many smaller devices only work with SWD which typically use the smaller 10-pin SW-DP connecter (the LPC1300 family, for example, only supports SWD). 2x05 1.27mm/0.05" Connector: This is the standard SMT connector defined by ARM for all Cortex devices, and should be used in most situations and for forward-compatibility since any new devices coming to market will likely use this connector. MOLEX 10 Pin 0.1" Connector: This 0.1" 10 pin connector has the same pin layout as the standard 0.05" connector, but is easier to work with if you are using standard jumper wires or custom cables to connect your SWD hardware. MOLEX 20 Pin 0.1" Connector: This 0.1" 20 pin connector is the same model used for ARM7/ARM9 JTAG debuggers, but is connected to match the pins on the Segger J-Link for ARM (which supports both JTAG and SWD debugging). See the following document from ARM for more information on Cortex M3 Debug Connectors: http://infocenter.arm.com/help/topic/com.arm.doc.faqs/attached/13634/cortex_debug_connectors.pdf And the following page for an overview with images of the different connector types: http://www.keil.com/peripherals/coresight/connectors.asp
L0 L3-L7 L9-L12 LC = microbuilder_v3:INDUCTOR: Inductors
L1 = Coilcraft_XAL:XFL4020
L2 = SparkFun:INDUCTOR: Inductors
L8 = Coilcraft_XAL:EPL2010
LED1 LED2 = led:LED: LED OSRAM: - CHIPLED LG R971, LG N971, LY N971, LG Q971, LY Q971, LO R971, LY R971 LH N974, LH R974 LS Q976, LO Q976, LY Q976 LO Q996 - Hyper CHIPLED LW Q18S LB Q993, LB Q99A, LB R99A - SideLED LS A670, LO A670, LY A670, LG A670, LP A670 LB A673, LV A673, LT A673, LW A673 LH A674 LY A675 LS A676, LA A676, LO A676, LY A676, LW A676 LS A679, LY A679, LG A679 - Hyper Micro SIDELED® LS Y876, LA Y876, LO Y876, LY Y876 LT Y87S - SmartLED LW L88C, LW L88S LB L89C, LB L89S, LG L890 LS L89K, LO L89K, LY L89K LS L896, LA L896, LO L896, LY L896 - TOPLED LS T670, LO T670, LY T670, LG T670, LP T670 LSG T670, LSP T670, LSY T670, LOP T670, LYG T670 LG T671, LOG T671, LSG T671 LB T673, LV T673, LT T673, LW T673 LH T674 LS T676, LA T676, LO T676, LY T676, LB T676, LH T676, LSB T676, LW T676 LB T67C, LV T67C, LT T67C, LS T67K, LO T67K, LY T67K, LW E67C LS E67B, LA E67B, LO E67B, LY E67B, LB E67C, LV E67C, LT E67C LW T67C LS T679, LY T679, LG T679 LS T770, LO T770, LY T770, LG T770, LP T770 LB T773, LV T773, LT T773, LW T773 LH T774 LS E675, LA E675, LY E675, LS T675 LS T776, LA T776, LO T776, LY T776, LB T776 LHGB T686 LT T68C, LB T68C - Hyper Mini TOPLED® LB M676 - Mini TOPLED Santana® LG M470 LS M47K, LO M47K, LY M47K Source: http://www.osram.convergy.de LUXEON: - LUMILED® LXK2-PW12-R00, LXK2-PW12-S00, LXK2-PW14-U00, LXK2-PW14-V00 LXK2-PM12-R00, LXK2-PM12-S00, LXK2-PM14-U00 LXK2-PE12-Q00, LXK2-PE12-R00, LXK2-PE12-S00, LXK2-PE14-T00, LXK2-PE14-U00 LXK2-PB12-K00, LXK2-PB12-L00, LXK2-PB12-M00, LXK2-PB14-N00, LXK2-PB14-P00, LXK2-PB14-Q00 LXK2-PR12-L00, LXK2-PR12-M00, LXK2-PR14-Q00, LXK2-PR14-R00 LXK2-PD12-Q00, LXK2-PD12-R00, LXK2-PD12-S00 LXK2-PH12-R00, LXK2-PH12-S00 LXK2-PL12-P00, LXK2-PL12-Q00, LXK2-PL12-R00 Source: www.luxeon.com KINGBRIGHT: KA-3528ASYC Source: www.kingbright.com
Q1-Q4 = nxp:NX2301P
Q5 = PBSS4130:PBSS4130
Q6 = PD84001:PD84001
R1-R33 = microbuilder_v3:RESISTOR: Resistors 0402 - 0402 Surface Mount Package 22 Ohm 1% 1/16W [Digikey: 311-22.0LRTR-ND] 33 Ohm 5% 1/16W 1.0K 5% 1/16W 1.5K 5% 1/16W 2.0K 1% 1/16W 10.0K 1% 1/16W [Digikey: 311-10.0KLRTR-ND] 10.0K 5% 1/16W [Digikey: RMCF0402JT10K0TR-ND] 12.1K 1% 1/16W [Digikey: 311-22.0LRTR-ND] 100.0K 5% 1/16W 0603 - 0603 Surface Mount Package 0 Ohm 1/10 Watt 1% Resistor 15 Ohm 1/10 Watt 1% Resistor 33 Ohm 1/10 Watt 1% Resistor 49.9 Ohm 1/10 Watt 1% Resistor 100 Ohm 1/10 Watt 1% Resistor 150 Ohm 1/10 Watt 1% Resistor 240 Ohm 1/10 Watt 1% Resistor 390 Ohm 1/10 Watt 1% Resistor 560 Ohm 1/10 Watt 1% Resistor 680 Ohm 1/10 Watt 1% Resistor 750 Ohm 1/10 Watt 1% Resistor 1.0K Ohm 1/10 Watt 1% Resistor 1.5K Ohm 1/10 Watt 1% Resistor 2.0K Ohm 1/10 Watt 1% Resistor 2.2K Ohm 1/10 Watt 1% Resistor 3.3K Ohm 1/10 Watt 1% Resistor 4.7K Ohm 1/10 Watt 1% Resistor 10.0K Ohm 1/10 Watt 1% Resistor 12.0K Ohm 1/10 Watt 1% Resistor 12.1K Ohm 1/10 Watt 1% Resistor 20.0K Ohm 1/10 Watt 1% Resistor 33.0K Ohm 1/10 Watt 1% Resistor 100.0K Ohm 1/10 Watt 1% Resistor 0805 - 0805 Surface Mount Package 0 Ohm 1/8 Watt 1% Resistor 33 Ohm 1/8 Watt 1% Resistor 100 Ohm 1/8 Watt 1% Resistor 150 Ohm 1/8 Watt 1% Resistor 200 Ohm 1/8 Watt 1% Resistor 240 Ohm 1/8 Watt 1% Resistor 330 Ohm 1/8 Watt 1% Resistor 390 Ohm 1/8 Watt 1% Resistor 470 Ohm 1/8 Watt 1% Resistor 1.0K Ohm 1/8 Watt 1% Resistor 1.5K Ohm 1/8 Watt 1% Resistor 2.0K Ohm 1/8 Watt 1% Resistor 4.7K Ohm 1/8 Watt 1% Resistor 5.1K Ohm 1/8 Watt 1% Resistor 5.6K Ohm 1/8 Watt 1% Resistor 10.0K Ohm 1/8 Watt 1% Resistor 22.0K Ohm 1/8 Watt 1% Resistor 33.0K Ohm 1/8 Watt 1% Resistor 100K Ohm 1/8 Watt 1% Resistor 1206 - 1206 Surface Mount Package 2012 - 2010 Surface Mount Package 0.11 Ohm 1/2 Watt 1% Resistor - Digikey: RHM.11UCT-ND
U1 = fbri:SAM_D20E
U2 = fbri:SI4060
U3 = fbri:SE880
U4 = fbri:SST25WF040BT-40I/NP
U5 = fbri:TG-5006CJ
U6 = TPS73118DVBT:TPS73118DBVT: Cap-Free, NMOS, 150mA Low Dropout Regulator with Reverse Current Protection; MPN: TPS73118DBVT; OC_FARNELL: 1135388; OC_NEWARK: 87H2948; PACKAGE: SOT-23-5; SUPPLIER: Texas Instruments
U7 = TPS3125:TPS3123
U8 = SN74LVC1G32DCKR:SN74LVC1G32DCKR: 2-INPUT POSITIVE-OR GATE; MPN: SN74LVC1G32DCKR; OC_FARNELL: 1470880; OC_NEWARK: 76C4094; PACKAGE: SC-70-5; SUPPLIER: Texas Instruments
U9 = TPS62243:TPS62243
U10 U11 = fbri:SIT1552
U12 = LTC4070_EMS8:LTC4070EMS8EPBF: Li-Ion/Polymer Shunt Battery Charger System; MPN: LTC4070EMS8E#PBF; OC_FARNELL: 1839141; OC_NEWARK: 67R4287; PACKAGE: MSOP-8; SUPPLIER: Linear Technology
U13 = ADP1614:ADP1614ACPZ-1.3-R7: IC BOOST, 5.5VIN, 650K-1.3MHZ, 4A, 10LFCSP; MPN: ADP1614ACPZ-1.3-R7; OC_FARNELL: 2191713; OC_NEWARK: 44W3805; PACKAGE: LFCSP-10; SUPPLIER: ANALOG DEVICES
U14 U15 = TPS71533DCKR:TPS71533DCKR: Linear Regulator; MPN: TPS71533DCKR; OC_FARNELL: 1135383; OC_NEWARK: 77C0815; PACKAGE: SC-70-5; SUPPLIER: Texas Instruments
U16-U18 = 74LVC1G04GW_inverter:74LVC1G04GW: Single inverter; MPN: 74LVC1G04GW; OC_FARNELL: 1631683; OC_NEWARK: 03P2774; PACKAGE: SOT-5; SUPPLIER: NXP
U19 = SKYWORKS:AS213-92
U20 = SKY13373:SKY13373

## Board
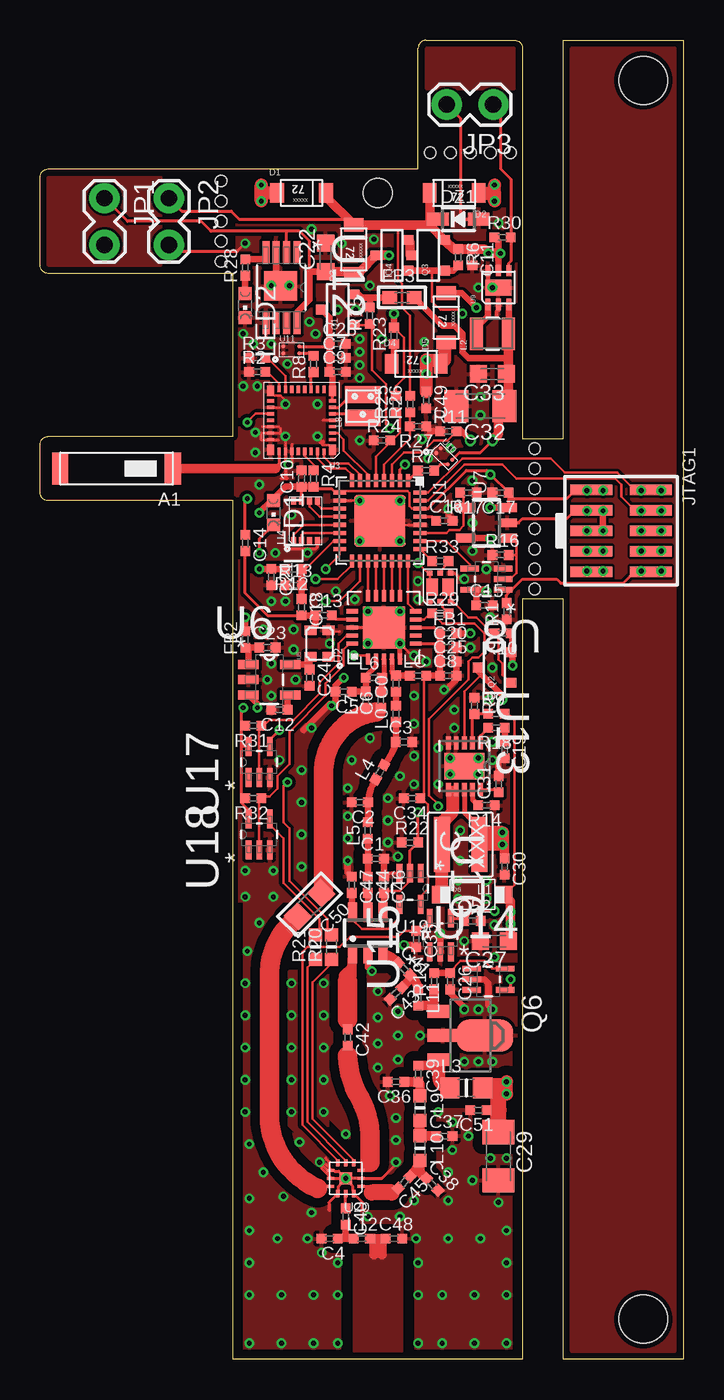
[diagram p3: board, top side]
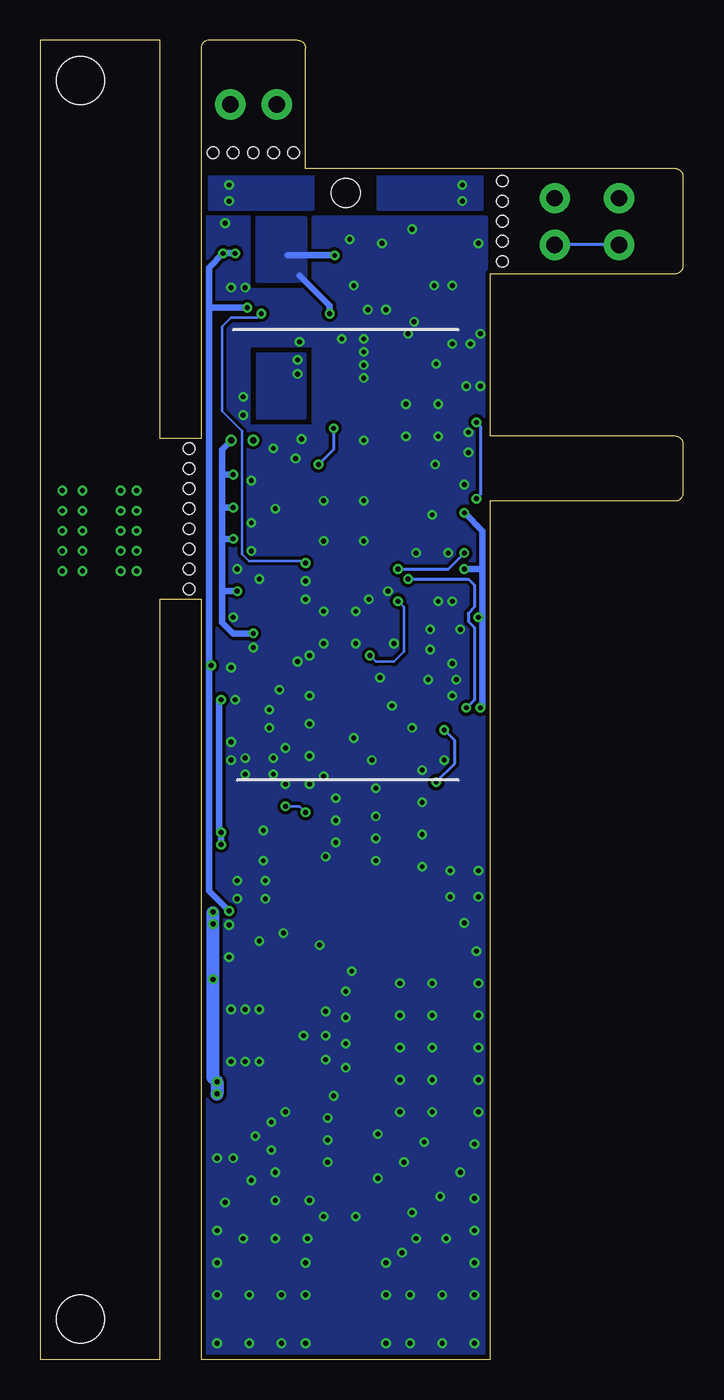
[diagram p4: board, bottom side, seen from below]

Size 40 x 82 mm. Coordinates in mm from the lower left corner, seen from the top.
Outline: 12,0 12,53.38 0.5,53.38 arc-90 0,53.88 0,56.88 arc-90 0.5,57.38 12,57.38 12,67.5 0.5,67.5 arc-90 0,68 0,73.5 arc-90 0.5,74 23.5,74 23.5,81.5 arc-90 24,82 29.5,82 arc-90 30,81.5 30,57.25 32.54,57.25 32.54,82 40,82 40,0 32.54,0 32.54,47.25 30,47.25 30,0 12,0
Copper layers (1*16): Top 0.035mm / dielectric 1.5mm / Bottom 0.035mm
Design rules "PCB-POOL Standard *": minimum track width 0.15mm, minimum drill 0.3mm, track to track 0.15mm, track to pad 0.15mm, pad to pad 0.15mm, via to via 0.15mm, smd to smd 0.15mm, copper to edge 0.3mm, drill to drill 0.2mm, minimum pad ring 0.2mm, minimum via ring 0.15mm, stop-mask expansion 0.075mm, vias tented up to drill 12mil, thermal gap 0.2mm
Holes 0.7 mm at 30.75,56.62 30.75,47.88 30.75,49.12 30.75,50.38 30.75,51.62 30.75,52.88 30.75,54.12 30.75,55.38 11.25,68.25 11.25,70.75 11.25,72 11.25,73.25 11.25,69.5 24.25,75 25.5,75 26.75,75 28,75 29.25,75
Holes 3 mm at 37.5,79.5 37.5,2.5
Holes 1.8 mm at 21,72.5

### Footprints (pad centres in the part's own frame; a part is rotated, then mirrored left to right if it is on the bottom)
1575AT43A40 = smd 1 x 2: 1 -3.5,0; 2 3.5,0
_0402 = smd 0.6 x 0.6: 1 -0.508,0; 2 0.508,0
C0603K = smd 1.05 x 1.08: 1 -0.875,0; 2 0.875,0
C1206K = smd 1.5 x 2: 1 -1.5,0; 2 1.5,0
_0805 = smd 1.2 x 1.3: 1 -1.016,0; 2 1.016,0
RB161M = smd 1.2 x 0.85: ANODE 0,-1.525; CATHODE 0,1.525
SOD123W = smd 1.1 x 1.1: P$1 -1.95,0; P$2 1.95,0
SOD-323 = smd 1.35 x 0.8: A 1.27,0; C -1.27,0
_0603 = smd 0.9 x 0.8: 1 -0.762,0; 2 0.762,0
1X02_LOCK = drill 1.016 pad 1.88: 1 -0.178,0; 2 2.718,0
2X05_1.27MM_SMT = smd 0.65 x 2.6: 1 -2.54,-1.85; 2 -2.54,1.85; 3 -1.27,-1.85; 4 -1.27,1.85; 5 0,-1.85; 6 0,1.85; 7 1.27,-1.85; 8 1.27,1.85; 9 2.54,-1.85; 10 2.54,1.85
_0402@2 = smd 0.6 x 0.6: 1 -0.508,0; 2 0.508,0
XFL4020 = smd 0.98 x 3.4: 1 -1.185,0; 2 1.138,0
1007 = smd 2 x 0.8: 1 0,1; 2 0,-1
_0805MP = smd 1.2 x 1.3: 1 -1.016,0; 2 1.016,0
EPL2010 = smd 1.04 x 2.2: 1 -0.725,0; 2 0.725,0
_0603MP = smd 0.8 x 0.8: 1 -0.762,0; 2 0.762,0
CHIPLED_0603 = smd 0.8 x 0.8: A 0,-0.75; C 0,0.75
SOT23 = smd 0.6 x 0.7: 1 -0.95,-1; 2 0.95,-1; 3 0,1
SOT1118 = smd 0.35 x 0.3: P1 -0.65,-0.875; P2 0,-0.875; P3 0.65,-0.875; P4 0.65,0.875; P5 0,0.875; P6 -0.65,0.875 | smd 0.72 x 1.05: P7 -0.49,0; P8 0.49,0
SOT-89 = smd 0.8 x 1.4: 1 -1.499,-0.711; 3 1.499,-0.711 | smd 0.8 x 1.9: 2 0,-0.457 | smd 2 x 3.5: 2.1 0,2.159
QFN32_5MM = smd 0.8 x 0.25: 1 -2.5,1.75; 2 -2.5,1.25; 3 -2.5,0.75; 4 -2.5,0.25; 5 -2.5,-0.25; 6 -2.5,-0.75; 7 -2.5,-1.25; 8 -2.5,-1.75; 17 2.5,-1.75; 18 2.5,-1.25; 19 2.5,-0.75; 20 2.5,-0.25; 21 2.5,0.25; 22 2.5,0.75; 23 2.5,1.25; 24 2.5,1.75 | smd 0.25 x 0.8: 9 -1.75,-2.5; 10 -1.25,-2.5; 11 -0.75,-2.5; 12 -0.25,-2.5; 13 0.25,-2.5; 14 0.75,-2.5; 15 1.25,-2.5; 16 1.75,-2.5; 25 1.75,2.5; 26 1.25,2.5; 27 0.75,2.5; 28 0.25,2.5; 29 -0.25,2.5; 30 -0.75,2.5; 31 -1.25,2.5; 32 -1.75,2.5 | smd 3.2 x 3.2: 33 0,0
QFN20 = smd 0.7 x 0.25: 1 -1.97,1; 2 -1.97,0.5; 3 -1.97,0; 4 -1.97,-0.5; 5 -1.97,-1; 11 1.97,-1; 12 1.97,-0.5; 13 1.97,0; 14 1.97,0.5; 15 1.97,1 | smd 0.25 x 0.7: 6 -1,-1.97; 7 -0.5,-1.97; 8 0,-1.97; 9 0.5,-1.97; 10 1,-1.97; 16 1,1.97; 17 0.5,1.97; 18 0,1.97; 19 -0.5,1.97; 20 -1,1.97 | smd 2.6 x 2.6: PAD 0,0
SE880 = smd 0.45 x 0.65: 1 -1.925,1.825; 9 -1.925,-1.825; 18 1.925,-1.825; 26 1.925,1.825 | smd 0.45 x 0.2: 2 -1.925,1.2; 3 -1.925,0.8; 4 -1.925,0.4; 5 -1.925,0; 6 -1.925,-0.4; 7 -1.925,-0.8; 8 -1.925,-1.2; 19 1.925,-1.2; 20 1.925,-0.8; 21 1.925,-0.4; 22 1.925,0; 23 1.925,0.4; 24 1.925,0.8; 25 1.925,1.2 | smd 0.2 x 0.45: 10 -1.4,-1.925; 11 -1,-1.925; 12 -0.6,-1.925; 13 -0.2,-1.925; 14 0.2,-1.925; 15 0.6,-1.925; 16 1,-1.925; 27 1.4,1.925; 28 1,1.925; 29 0.6,1.925; 30 0.2,1.925; 31 -0.2,1.925; 32 -0.6,1.925; 33 -1,1.925 | smd 0.2 x 0.39: 17 1.4,-1.955; 34 -1.4,1.955
USON-8 = smd 0.3 x 0.5: 1 -0.75,-1.25; 2 -0.25,-1.25; 3 0.25,-1.25; 4 0.75,-1.25; 5 0.75,1.25; 6 0.25,1.25; 7 -0.25,1.25; 8 -0.75,1.25
TC-5006CJ = smd 0.6 x 0.75: 1 -0.825,-0.565; 2 0.825,-0.565; 3 0.825,0.565; 4 -0.825,0.565
SOT95P280X145-5N = smd 1.27 x 0.559: 1 -1.295,0.94; 2 -1.295,0; 3 -1.295,-0.94; 4 1.295,-0.94; 5 1.295,0.94
SOT23-5 = smd 0.55 x 1.2: 1 -0.95,-1.3; 2 0,-1.3; 3 0.95,-1.3; 4 0.95,1.3; 5 -0.95,1.3
SOT65P210X110-5N = smd 1.168 x 0.356: 1 -1.041,0.66; 2 -1.041,0; 3 -1.041,-0.66; 4 1.041,-0.66; 5 1.041,0.66
S-PWSON-N6 = smd 0.3 x 0.7: 1 -0.65,-1.05; 2 0,-1.05; 3 0.65,-1.05; 4 0.65,1.05; 5 0,1.05; 6 -0.65,1.05 | smd 1.6 x 1: PAD 0,0
SIT1552 = smd 0.25 x 0.25: 1 -0.5,-0.205; 2 0.5,-0.205; 3 0.5,0.205; 4 -0.5,0.205
SOP65P490X110-9N = smd 1.397 x 0.432: 1 -2.184,0.965; 2 -2.184,0.33; 3 -2.184,-0.33; 4 -2.184,-0.965; 5 2.184,-0.965; 6 2.184,-0.33; 7 2.184,0.33; 8 2.184,0.965 | smd 1.829 x 2.057: 9 -0.102,-0.051
DFN50P300X300X80-11N = smd 0.813 x 0.305: 1 -1.448,0.991; 2 -1.448,0.508; 3 -1.448,0; 4 -1.448,-0.508; 5 -1.448,-0.991; 6 1.448,-0.991; 7 1.448,-0.508; 8 1.448,0; 9 1.448,0.508; 10 1.448,0.991 | smd 1.651 x 2.489: 11 0,0
SOT65P210X110-5N' = smd 1.168 x 0.356: 1 -0.965,0.66; 2 -0.965,0; 3 -0.965,-0.66; 4 0.965,-0.66; 5 0.965,0.66
SOT-6 = smd 0.55 x 1.2: 1 -0.95,-1.3; 2 0,-1.3; 3 0.95,-1.3; 4 0.95,1.3; 5 0,1.3; 6 -0.95,1.3
SKY13373 = smd 0.44 x 0.2: 1 -0.95,0.5; 2 -0.95,0; 3 -0.95,-0.5; 7 0.95,-0.5; 8 0.95,0; 9 0.95,0.5 | smd 0.2 x 0.44: 4 -0.5,-0.95; 5 0,-0.95; 6 0.5,-0.95; 10 0.5,0.95; 11 0,0.95; 12 -0.5,0.95 | smd 0.76 x 0.76: PAD 0,0

### Placement (x,y rotation side)
A1  4.75,55.38 180 top
C0  22.12,42 90 top
C1  20.88,31.12 0 top
C2  19.88,34.62 180 top
C3  22.62,38.38 0 top
C4  18,7.5 180 top
C5  18.88,41.5 180 top
C6  21.19,41 90 top
C7  18.5,62.25 0 top
C8  25.38,42.5 0 top
C9  18.5,61.38 0 top
C10  16.25,54.75 90 top
C11  26.88,68.5 270 top
C12  14.88,40.38 180 top
C13  17.62,46.25 0 top
C14  12.75,50.75 270 top
C15  27.62,46.88 0 top
C16  25.12,52.12 0 top
C17  28.62,53.88 180 top
C18  16.25,46.75 270 top
C19  28.88,37.88 270 top
C20  25.38,44.25 0 top
C21  14.38,48.62 270 top
C22  17.75,68.5 90 top
C23  14.12,44.25 0 top
C24  16.75,42.38 270 top
C25  25.38,43.38 0 top
C26  25.5,23.5 270 top
C27  28.25,26 180 top
C28  18.5,63.12 0 top
C29  28.5,12.62 270 top
C30  28.88,30.62 270 top
C31  28.5,35.75 90 top
C32  27.38,59.25 180 top
C33  28.12,61.25 180 top
C34  23.12,34.88 180 top
C35  23.38,26.12 270 top
C36  22.12,17.25 180 top
C37  25.12,13.88 0 top
C38  24.38,10.88 315 top
C39  23.5,17.75 270 top
C40  19,8.88 270 top
C41  22.62,24.25 315 top
C42  19.12,20 270 top
C43  22.12,22.75 225 top
C44  20.38,29.5 270 top
C45  22.62,11 225 top
C46  21.38,29.5 270 top
C47  19.38,29.5 270 top
C48  22,7.5 0 top
C49  24,59.62 270 top
C50  16.75,28.25 225 top
C51  27.25,15.5 180 top
C52  26.88,27.25 0 top
D1  16.25,72.5 270 top
D2  25.75,72.5 90 top
D3  19.5,69 0 top
D4  23.38,61.88 270 top
D5  25.25,64.75 0 top
D6  26.88,28.88 0 top
DZ1  26,70.88 0 top
FB1  25.38,45.12 0 top
FB2  12.75,44.75 90 top
FB3  22.5,66 0 top
JP1  4,72 270 top
JP2  8,72 270 top
JP3  28,78 180 top
JTAG1  36.12,51.5 270 top
L0  22.12,40.12 90 top
L1  26.12,32 180 top
L2  28.12,63.75 90 top
L3  26.5,16.88 0 top
L4  21.12,36.5 60 top
L5  20.38,32.88 90 top
L6  20.75,42.38 0 top
L7  20.25,41 90 top
L8  20.06,59.25 90 top
L9  23.62,15.62 270 top
L10  23.62,13.12 270 top
L11  23.5,22.5 270 top
L12  20,7.5 0 top
LC  23.5,42.5 0 top
LED1  14.5,52.62 180 top
LED2  12.75,65.5 180 top
Q1  18.5,65.25 90 top
Q2  28.25,43 90 top
Q3  24.12,68.62 90 top
Q4  21.88,68.62 90 top
Q5  24.88,48 0 top
Q6  25.5,20.12 270 top
R1  29,46.5 90 top
R2  13.5,61.38 0 top
R3  13.5,62.25 0 top
R4  17,54.75 270 top
R5  27,40.62 270 top
R6  26,68.5 270 top
R7  24,55.25 0 top
R8  17,61.88 90 top
R9  28.38,40.12 0 top
R10  28.75,45.12 180 top
R11  25.38,57.69 0 top
R12  15.75,49.12 180 top
R13  15.75,48.12 0 top
R14  27.75,34.44 180 top
R15  20.5,64.88 90 top
R16  28.62,50 0 top
R17  26.62,53.88 180 top
R18  28.38,39.25 180 top
R19  24.5,23.5 90 top
R20  18.12,25.62 90 top
R21  17.12,25.62 90 top
R22  23,32.12 0 top
R23  22,63.62 90 top
R24  21.25,57.12 0 top
R25  22.12,59.38 90 top
R26  23,59.38 90 top
R27  23.5,58 180 top
R28  12.75,67.88 90 top
R29  24.88,46.38 0 top
R30  28.75,69.75 0 top
R31  13.25,39.38 180 top
R32  13.25,34.88 180 top
R33  24.88,49.62 0 top
U1  21.12,52.12 270 top
U2  21.38,45.5 90 top
U3  16.25,58.38 180 top
U4  16.5,52.12 0 top
U5  17.38,44.5 90 top
U6  14.25,42.25 0 top
U7  27.75,52 90 top
U8  27.75,48.5 180 top
U9  28.5,66.62 0 top
U10  25.12,56.12 315 top
U11  15.62,62.75 0 top
U12  15,66.62 270 top
U13  26.38,36.88 270 top
U14  27.88,23.62 0 top
U15  24.88,26.38 90 top
U16  74LVC1G04GW  [SOT65P210X110-5N']  23,29.25 270 top
U17  74LVC1G04GW  [SOT65P210X110-5N']  13.62,37.12 90 top
U18  74LVC1G04GW  [SOT65P210X110-5N']  13.62,32.62 90 top
U19  20.38,26.5 0 top
U20  19,11.25 180 top

### Tracks (layer width: path | path; a pad name or v marks a point on that pad's centre or on a via)
1.8V  (via drill 0.3, 0.4)
  Top 0.152: R4.2 17.12,54.12 | U1.9 18.94,53.88 19.03,53.97 | 19.03,53.97 22.84,53.97 22.97,53.84 22.97,53.03 23.12,52.88 U1.30 | 18.28,53.97 19.03,53.97
  Top 0.2: U1.30 24.12,52.88 26.5,55.25 27.75,55.25 v28,55 29.13,53.87 | 17.12,54.12 18.12,54.12 18.28,53.97 | 18.38,53.88 U1.9 | U4.8 U4.7 C10.1 | U7.3 29.2,52.95 29.25,53 29.13,53.12 29.13,53.5 | 29.13,53.5 32.75,53.5 33.25,54 v34,54 | 29.13,53.5 29.13,53.87 | 29.13,53.87 C17.1 | v28.12,57.12 27.38,56.38 26.08,56.38 U10.3 | v12.62,40.5 12.5,40.38 12.5,39.5 | 12.5,39.5 12.5,38.09 | 12.5,38.09 12.5,34.88 | 12.5,34.88 12.5,34.62 12.96,34.16 U18.5 | R31.2 12.62,39.5 12.5,39.5 | U17.5 12.5,38.09 | R32.2 12.5,34.88 | R4.2 17,54.12
  Top 0.4: v35,54 v34,54 34.04,54.04 JTAG1.1 | U7.5 28,51.05 v28,51 | U7.3 v28,52.95 | U9.3 29.15,63.27 29.12,63.25 | FB2.2 v12.75,46.12 | 29.06,62.19 29.12,62.25 26.62,62.25 26.25,62.62 26.25,63.75 25.75,64.25 25,64.25 23.39,65.86 FB3.2 | v27.75,47.75 27.66,47.84 27.12,47.84 | 27.12,47.84 U8.5 | C15.1 27.12,47.84 | FB1.2 v26.75,45.12 | R4.2 C10.1 15.24,54.24 14.44,53.44 | v13.62,52.62 14.44,53.44 | LED1.A 14.44,53.44 | R12.2 15.23,49.13 C21.1 14.37,49.12 v13.62,49.12
  Top 0.6: L2.2 29.12,63.25 29.12,62.25 29.12,61.12 | 29.12,61.12 29.12,59.5 C32.1 28.88,59.12 28.5,58.75 28.5,57.5 v28.12,57.12 | C33.1 29.12,61.12
  Bottom 0.2: v28.12,57.12 28.06,57.12
  Bottom 0.4: 12.5,49.12 12.5,51.5 v13.62,52.62 | 12.5,49.12 v13.62,49.12 | 12.5,49.12 12.5,46.12 | 12.5,46.12 12.5,40.62 v12.62,40.5 | v12.75,46.12 12.5,46.12 | 28.69,47.75 28.69,45.81 28,45.12 v26.75,45.12 | 28.69,47.75 28.69,51 | 28.69,51 28.69,52.94 | 28.69,52.94 28.69,56.56 v28.12,57.12 | v28,55 28.62,55 | v28,52.95 28.05,52.95 28.06,52.94 28.69,52.94 | v28,51 28.69,51 | v27.75,47.75 28.69,47.75
1.8V_EN
  Top 0.2: U9.4 29.15,68.15 29.27,68.28 29.27,69.75 R30.2 29.26,73.37 28.62,74 28.62,77.55 JP3.1
2M_FILTER_1
  Top 0.6: L9.1 23.62,17.12 C39.2 C36.1
2M_FILTER_2
  Top 0.6: L10.1 L9.2 23.5,13.88 C37.1
2M_FILTER_3
  Top 0.6: C45.1 arc30 23.62,12.38 L10.2 23.62,11.62 C38.1
7.5V  (via drill 0.3)
  Top 0.152: R9.2 28.88,40 29.25,40 29.5,39.75 29.5,29.5 28.88,28.88 D6.P$2
  Top 0.2: C51.1 28.5,15.5 | v29.25,23.62 29.25,22.96 U14.4
  Top 0.6: 28.75,16.88 29,16.88 v29,17.25 | D6.P$2 29.25,28.45 v29.25,27.81 v29.25,27.06 29.25,26.12 C27.1
  Top 0.8: v29,16.5 v29,17.25
  Top 1: C29.1 28.5,15.5 28.5,16.88
  Top 1.2: L3.2 28.5,16.88 28.75,16.88
  Bottom 0.2: 29.25,27.75 v29.25,27.81
  Bottom 0.8: 29.25,27.75 v29.25,23.62 29.25,17.5 v29,17.25 v29,16.5
!GPS_EN  (via drill 0.3)
  Top 0.152: v21.75,57.88 21.5,58.12 21.5,60.62 20.62,61.5 20.62,64.12 20.44,64.3 | 20.44,64.3 Q1.1 | R15.1 20.44,64.31 20.44,64.3
  Top 0.2: U1.2 22.38,55.31 v22.69,55.62
  Bottom 0.2: v21.75,57.88 21.75,56.56 v22.69,55.62
!RESET
  Top 0.152: U1.26 25.25,50.88 26.71,49.42 U8.4
AMPL_DRAIN
  Top 0.6: C39.1 24.79,18.26 Q6.3
  Top 0.8: L3.1 arc-90 24.79,17.57 Q6.3
AMPL_GATE
  Top 0.6: L11.2 24.5,21.99 | 24.5,21.99 R19.1 | 24.5,21.99 24.5,21.62 Q6.1
AMPL_IN
  Top 0.6: L11.1 23.5,23.12 arc30 C41.2 23.11,23.73 C43.1
AMPL_IN1
  Top 0.4: U19.3 21.43,25.2
  Top 0.6: 21.43,25.2 arc-30 C41.1
AMPL_OUT
  Top 0.2: C45.2 22.12,10.5 21.88,10.38 | U20.1 20.7,10.75 20.62,10.38
  Top 1: 21.88,10.38 20.62,10.38
ANT
  Top 0.6: 20.75,6.5 20.75,7.5 | 20.75,7.5 21.25,7.5 | 21.25,7.5 21.25,6.5 | L12.2 20.75,7.5 | 21.25,7.5 C48.1
  pour Top: 19.5,0.5 22.5,0.5 22.5,6.5 19.5,6.5
ANT1
  Top 0.4: C4.1 19,7.5 | 19,7.5 L12.1 | C40.2 19,7.5
BATTERY  (via drill 0.3)
  Top 0.152: R25.2 22.12,60.5 22.62,61 22.62,63.5 22.26,63.88 R23.2
  Top 0.2: 16.75,67.62 16.75,69.5 16.12,70.12 15.38,70.12 | 15.38,70.12 10.62,70.12 10,70.75 5.43,70.75 JP1.1 | U12.2 15.33,70.08 15.38,70.12
  Top 0.4: U12.8 15.96,65.09 16.75,65.88 16.75,67.62 C22.1 | v22,65 R23.2
  Top 0.6: 19.5,67.62 C22.1 | D3.ANODE 19.5,67.62 | 19.5,67.62 19.88,67.62 Q4.3 v21.69,68.62
  Bottom 0.4: 24.62,68.62 v21.69,68.62 | v22,65 22,65.5 23.88,67.38
  pour Bottom: 23.5,71 23.5,67 26.5,67 26.5,71
BATTERY_MOSFET_1
  Top 0.6: Q4.2 23,69.45 23,68.62 Q3.3
BATTERY_SENSE
  Top 0.152: R25.1 22.26,58.74 22.38,58.62 22.38,57.62 21.82,57.06 | U1.5 20.88,56.12 21.82,57.06 | R24.2 21.82,57.06
BOOST_COMP
  Top 0.2: U13.1 27.37,38.75 R18.2
BOOST_COMP_1
  Top 0.4: R18.1 C19.1
BOOST_CURRENTLIMIT
  Top 0.3: U13.9 26.88,34.8 R14.2
BOOST_FB
  Top 0.2: U13.2 26.88,40 R5.2 R9.1
BOOST_SOFTSTART
  Top 0.2: U13.10 28.32,35.43 C31.1
BOOST_SUPPLY  (via drill 0.3)
  Top 0.152: U13.3 26.38,41.5 27.38,42.5
  Top 0.2: 27.38,42.5 27.38,42.88 Q2.3
  Top 0.3: U13.8 26.38,34 27.25,33.12 27.25,31.81 L1.1
  Top 0.4: Q2.3 27.25,42.75 28.75,41.25 v28.75,41
  Top 0.6: C30.1 28.88,32.75 v28.75,32.75
  Top 0.8: v28.75,32 L1.1 | v28.75,32.75 27.5,32.75
  Bottom 0.4: v28.75,41 28.88,40.88 28.88,32.88 v28.75,32.75 v28.75,32
BOOST_SUPPLY_CTRL_B
  Top 0.152: Q5.P2 25,47.12 25,46.76 R29.2
BOOST_SUPPLY_CTRL_C
  Top 0.152: Q2.1 28.75,42.55 28.75,43.25 28.5,43.5 28.5,44.87 R10.2 28.12,45.12 27.12,46.12 26.62,46.12 25.62,47.12 Q5.P3 25.52,47.84 Q5.P8
BOOST_SW
  Top 0.2: U13.7 U13.6 25.38,35.25 25.62,35.25
  Top 0.8: D6.P$1 24.99,28.88 L1.2 24.99,33.38 25.25,33.62 25.62,34 25.62,35.25
BUCK_SW
  Top 0.4: U9.1 27.85,64.85 27.12,64.12 L2.1
BYPASS
  Top 0.2: U20.3 20,11.75 | 20,11.75 20.62,11.75 20.5,12.25 | 20,11.75 20,12.38
  Top 0.4: C42.2 19.12,18.88
  Top 1.2: 19.12,18.88 arc30 19.88,16.25 arc-30 20.5,13.62 20.5,12.25
BYPASS1
  Top 0.4: C42.1 19.12,21.12 | 19.38,24.88 19.43,25.05 U19.1 | 19.38,23.88 19.12,23.62 19.12,23.5
  Top 0.6: 19.38,24.88 19.38,24.38 | 19.38,24.38 19.38,23.88 | 18.88,23.88 19.38,24.38
  Top 1.2: 19.12,21.12 19.12,23.5
CHG_CTRL
  Top 0.152: U1.25 24.37,49.63 R33.1
CHG_CTRL_B
  Top 0.152: Q5.P5 24.88,49 25.38,49.51 R33.2
CHG_CTRL_C  (via drill 0.3)
  Top 0.152: v26.25,65 26,65.25 24.88,65.25 24.38,65.75 24.38,67.5 24.55,67.67 | v23.5,49.5 24.12,48.88 Q5.P6 24.23,48.16 Q5.P7
  Top 0.4: Q4.1 24.55,67.67 Q3.1 25.68,67.67 R6.2
  Bottom 0.152: v23.5,49.5 23.62,49.62 27,49.62 27.44,50.06 27.44,57.69 28.69,58.94 28.69,64.19 28.12,64.75 26.5,64.75 v26.25,65
CHG_LED
  Top 0.4: R28.1 LED2.A
EXT!RESET  (via drill 0.3)
  Top 0.152: 36.88,49.12 37.5,49.12 | 37.5,49.12 37.81,49.12 JTAG1.10 38.59,48.96 v38.62,49 | v37.38,49 37.5,49.12
  Top 0.2: U8.1 29.34,47.84 | 29.34,47.84 30,48.5 32.12,48.5 32.38,48.25 36.25,48.25 36.88,48.88 36.88,49.12 | R1.2 29,47.5 29.34,47.84
EXT_THERMISTOR_SENSE  (via drill 0.4)
  Top 0.152: U1.3 21.88,55.62 22.62,56.38 23.75,56.38 24.5,57.12 25.32,57.12 R11.2
  Top 0.4: R11.2 26.19,57.69 v26.75,57.12
FILTER1
  Top 0.4: L0.1 C3.1 22.12,38.43 arc-30 L4.2
FILTER2
  Top 0.4: L5.2 20.38,34.38 C2.1 20.38,34.63 arc-30 L4.1
GIMO
  Top 0.152: U1.7 19.88,55 19.19,55.69 18.06,55.69 17.65,56.1 U3.34
GND  (via drill 0.3)
  Top 0.152: U1.10 v19.88,53.38 U1.33 21.12,53.38 v22.38,53.38 | U2.18 20.12,45.5 20.38,45.25 | U1.28 22.5,51.88 22.5,51 v22.38,50.88 | 18.62,45.25 18.36,45.25 | U2.PAD v22.38,46.5 | 14.32,60.17 U3.18 14.32,60.14 14.56,59.91 14.94,59.91 15.25,59.59 v15.25,59.38 15.05,59.17 U3.20 | v17.25,57.38 17.62,57 | 17.62,57 17.62,57.09 17.59,57.06 | 18.14,56.58 U3.1 18.11,56.67 17.94,56.84 17.56,56.84 17.41,57 17.62,57 | U3.5 17.59,58.38 | U3.28 v15.25,57.38 15.03,57.38 14.84,57.56 14.34,57.56 | 15.66,55.72 U3.29 | U3.29 | U3.29 15.66,56.91 | 13.81,57.97 14.81,57.97 14.94,57.84 14.94,57.59 | 14.34,57.56 13.75,57.56 13.75,57.19 13.78,57.16 14.81,57.16 | U3.24 14.34,57.56 | 34.26,52.75 JTAG1.3 34.3,52.75 v35,52.75 | v34,52.75 33.12,52.75
  Top 0.2: U3.28 15.25,54.75 | 15.25,54.75 15,54.75 | 15.25,54.75 15.38,54.75 | v22.38,44.5 23.12,43.75 v23.25,43.75 | U4.4 17.25,50.5 17.12,50.38 15.38,50.38 15.25,50.5 | 29.12,52 29.75,52 30,52.25 32.75,52.25 33.12,52.62 33.12,52.75 | 18,9.25 arc-90 17.95,9.3 17.95,9.75 U20.10 18.5,10.44 18.56,10.5 18.56,10.75 18.88,11.06 | 18,11.75 U20.7 18.25,11.75 18.31,11.69 18.56,11.69 18.75,11.5 | 18,11.75 17.88,11.75 v17.38,12.25 | 20,9.25 20,9.8 U20.12 19.5,10.44 19.44,10.5 19.44,10.75 U20.PAD U20.2 21.25,11.25 22.12,12.12 v22.12,12.25 | U16.3 21.38,30.21 21.38,30.5 | JP3.2 26.12,77.16 26.12,70.88 DZ1.A | 18,11.38 18,11.25 U20.8 18.81,11.25 | 17.88,11.5 17.5,11.88 | 18,11.75 17.88,11.62 17.88,11.5 | 17.88,11.5 18,11.38 | 18,11.38 18,11.75 | 18,11.75 18,11.88 | 18,11.88 17.75,12.12 | 18,11.88 18,12.25 17.75,12.5 | Q5.P4 25.75,48.88 26.12,48.5 v26.38,48.5 | JP2.2 8.41,68.88 12.25,68.88 v12.75,69.38
  Top 0.25: 28.5,65.75 28.5,65.25 28.38,65.12 28.38,64.88 | U9.6 27.85,66.9 v28.12,66.62
  Top 0.3: 24.12,57.38 24.25,57.5 24.25,57.75 24.75,57.75 | 24.75,57.75 24.75,57.62 | 24.75,57.75 24.62,57.62 24.38,57.62
  Top 0.305: 20.38,45.25 v20.38,44.5 | U2.5 v22.38,44.5
  Top 0.4: v35,52.75 v35,51.5 JTAG1.5 v34,51.5 | 34.26,52.75 v34,52.75 | C16.2 25.38,52.38 v25.38,52.88 | C26.2 25.51,22.74 26.38,21.88 v26.38,21.75 | U19.2 20.38,24.38 v20.62,24.12 | U15.2 v24.88,26.5 | v22.62,25.75 23.24,25.75 C35.2 | C47.1 19.12,30.26 v19.12,31 | U12.3 14.67,66.75 v14.38,66.75 | C46.1 21.38,30.5 C1.2 | U14.2 27.62,23.62 27.88,23.38 27.88,22 v28.12,21.75 | 18.38,41.88 v18.88,42.38 | 16.38,39.12 18,40.75 18.38,40.75 | 18.38,41.88 18.38,40.62 | 18.38,41.88 18.37,41.87 C5.2 | 25.38,41.75 25.88,42.25 25.88,43.37 C25.2 | C31.2 28.5,37.25 v28.12,37.25
  Bottom 0.2: JP1.2 JP2.2
  other vias: 19.88,50.88 19.12,32.38 18,44.5 20.38,46.5 13.38,56.38 13.62,54.38 15.44,55.62 14.38,47.12 19.88,57.12 18.12,40.62 23.5,47.25 25.12,41.62 13.25,63.12 15.38,61.88 19.88,62.62 17.25,59.38 14.38,63.12 18.5,65.25 19.62,65.25 19.88,61.81 26.88,50.25 19.88,63.44 19.88,61 13.5,60.5 19,11.25 23.62,20.12 27.25,21.75 26.38,18.5 27.25,18.5 28.12,18.5 25.75,39.25 23.25,35.75 23.25,39.5 23.25,41.25 26.88,52 26.88,54.62 13,13.38 12.75,15.38 12.75,17.38 21.75,16.38 22.12,15 22.12,13.62 21,18.12 22.25,18.62 15.62,17.38 12.75,19.38 15.62,15.38 24.75,15.38 25.62,14.75 26.62,13.88 28.5,9.75 25.62,13 26.88,11.12 16.12,13.5 17.62,17.38 17.62,15.38 15.62,19.38 17.62,19.38 19,14 17.62,21.38 17.62,23.38 15.62,21.38 15.62,23.38 12.88,25.38 12.75,21.38 12.75,23.38 21,19.62 21,21.25 21,22.88 22.25,21.62 22.25,20.12 25.75,40.38 26.75,44.25 13.88,11.62 15.12,10.12 16.88,9.12 20.38,8.88 23.25,9.88 25.38,9.88 25.38,11.62 29,12.5 28,12.5 19.12,35.5 20.5,38.62 16.88,39.25 16.25,36.62 16.25,32.62 16.25,30.62 27.75,49.12 12.62,60.5 12.62,63.75 15.5,66.75 16.75,64.5 17.12,63.75 23.88,63.25 23.75,57.2 27.38,59.83 27.38,58.7 18.75,69.38 16.88,70.25 27.25,66.62 28.12,38.38 13,10 13,8 13,6 13,4 13,1 29,1 29,4 29,6 29,8 15,1 17,1 18.5,1 18.5,4 18.5,6 23.5,6 23.5,4 23.5,1 25,1 27,1 17.5,6.62 22.38,8.88 23.38,7.5 16.62,7.5 14.75,7.5 25.38,7.5 27.38,7.5 15,4 17,4 25,4 27,4 15.62,52.5 21.62,32.12 21.62,33.5 25.5,37.38 25.5,36.38 27.25,36.38 27.25,37.38 28.25,27 26.38,26 28.25,25 28.5,70.62 20.75,69.62 20.5,66.75 21.25,63.44 24.12,56 25.5,56.62 22.25,31.25 14.12,42.25 13.88,45.38 15.88,42.25 14.5,28.75 15.75,44.12 14.38,43.25 14.38,41.25 26.12,32.88 26.12,31 16.25,34.62 19.12,33.75 19.38,37.25 23.25,37.5 27.88,41 28.12,43 28,46.12 21.62,34.88 22.38,36.25 24.75,35.75 24.75,38 24,43.38 14.88,37.25 13.62,27.12 12.75,28.75 12.75,30.38 14.5,30.38 27.75,28.62 26,28.62 27.75,29.75 26,29.75 23.5,48.38 15.75,45.38 13.38,57.62 16.62,50.12 15.25,47.12 19.56,47.25 14.62,50.12 18.38,47.75
  pour Top (isolate 0.2): 12.25,68.25 12.25,71.5 29.75,71.5 29.75,19.62 23.12,25.38 23.12,43.75 16.5,43.75 16.5,28.5 12,28.5
  pour Bottom (isolate 0.2): 12.25,71 23,71 23,66.5 27,66.5 27,71 29.75,71 29.75,63 23,63 23,58 27,58 27,62.94 29.75,62.94 29.75,0 12.25,0
  pour Top (isolate 0.6): 16.5,43.75 23.12,43.75 23.12,25.38 29.75,19.62 29.75,0.5 23.38,0.5 23.38,7.5 18.62,7.5 18.62,0.5 12,0.5 12,28.5 16.5,28.5
  pour Top (isolate 0.2): 17.88,24.12 17.88,12.12 15.5,14.5 15.5,24.12
GOMI
  Top 0.152: U3.33 17.25,56 17.88,55.38 19,55.38 19.38,55 U1.8
GPS_ANT
  Top 0.152: 14.88,55.75 14.62,55.5 14.62,55.38
  Top 0.2: U3.27 14.85,55.35 14.62,55.38
  Top 0.6: A1.1 14.62,55.38
GPS_VDD
  Top 0.4: Q1.2 19.8,66.2 20,66 20.5,66 | FB3.1 20.5,66 | R15.2 20.5,66
GPS_VDD_SWITCHED
  Top 0.2: U3.8 U3.9 | U11.3 17.82,62.95 C28.1
  Top 0.4: U3.9 18.18,61.19 C9.1 C7.1 C28.1 17.99,64.76 Q1.3
HBO
  Top 0.4: R28.2 14.04,68.38 U12.4
LED1  (via drill 0.3)
  Top 0.152: U1.16 18.62,50 v17.75,49.12
  Top 0.2: LED1.C 13.62,51 v13.62,50.12
  Bottom 0.2: v17.75,49.12 14.62,49.12 v13.62,50.12
LF_CLOCK
  Top 0.2: R7.1 22.88,54.63 U1.1
LF_CLOCK_OUT
  Top 0.2: U10.2 24.88,55.63 R7.2
LIION_CAP  (via drill 0.3)
  Top 0.8: 25.15,62.12 v24,62.12 v24,61.25 C49.1 | D5.ANODE 25.15,63.23 25.15,62.12 | 25.15,62.12 D4.CATHODE
  pour Bottom: 23.5,62.5 26.5,62.5 26.5,58.5 23.5,58.5
LIION_CAP_FEED
  Top 0.4: R23.1 22,62.1 D4.ANODE
MEM_CSN
  Top 0.152: U1.13 16.38,51.88 15.75,51.25 U4.1
MEM_MISO
  Top 0.152: U1.14 16.38,51.38 16.25,51.25 U4.2
MEM_MOSI
  Top 0.152: U1.11 17.5,52.88 17.25,53.12 U4.5
MEM_SCK
  Top 0.152: U1.12 17.38,52.38 16.75,53 U4.6
N$1  (via drill 0.3)
  other vias: 35,50.25
N$2  (via drill 0.3)
  other vias: 34,50.25
N$3  (via drill 0.3)
  other vias: 34,49
N$4  (via drill 0.3)
  other vias: 35,49
N$5
  pour Top: 33,0.5 39.5,0.5 39.5,81.5 33,81.5
N$6  (via drill 0.3)
  other vias: 38.62,50.25
N$7  (via drill 0.3)
  other vias: 38.62,51.5
N$8
  pour Top: 24,79 29.5,79 29.5,81.5 24,81.5
N$9
  pour Top: 7.5,68 0.5,68 0.5,73.5 7.5,73.5
N$10  (via drill 0.3)
  other vias: 37.38,50.25
N$11  (via drill 0.3)
  other vias: 37.38,51.5
RADIO_VDD
  Top 0.152: 24.88,44.62 C20.1 | 24.88,43.62 C25.1 | U16.5 23.66,28.79 24.12,29.25 24.12,34.5 23.88,34.75 23.88,34.76 | 23.88,34.76 23.88,42.37 LC.2 | 23.88,34.76 C34.1
  Top 0.2: U2.8 24.49,45.5 FB1.1 | U2.6 24.87,44.5 C20.1
  Top 0.4: LC.2 C8.1 | C8.1 | C8.1 C25.1 C20.1 FB1.1
RADIO_XIN
  Top 0.2: U2.17 18.38,46 C13.2
RF_SW_V2
  Top 0.152: U19.6 19.43,27.32 20,26.75 21.62,26.75 22.25,27.38 22.25,28.25 22.34,28.25 U16.4
  Top 0.4: U19.6 19.38,27.85 C47.2
RF_TANK
  Top 0.4: C0.1 L0.2
RF_TCXO_REG_EN  (via drill 0.3)
  Top 0.152: v17.12,48.5 18.5,48.5 19.38,49.38
  Top 0.2: U1.17 19.38,49.38
  Top 0.4: U6.3 13.5,40.77 v13.5,40.5
  Bottom 0.2: v17.12,48.5 13.38,48.5 13,48.12 13,46.75 13.38,46.38 13.38,45.88 13,45.5 13,41 v13.5,40.5
RTC_XI
  Top 0.2: U3.12 16.85,61.49 R8.1
RX
  Top 0.2: C50.1 17.62,29.12 | C6.1 21.12,40.49 20.88,40.25 20.63,40.49 L7.1
  Top 1.2: 17.62,29.12 17.62,36.62 arc-80 20.88,40.25
RX_1
  Top 0.2: U20.9 17.62,10.75 arc90 17.25,10.62 | 15.75,27.25 C50.2
  Top 1.2: 17.25,10.62 arc-60 14.25,14.75 14.25,24.12 arc-45 15.75,27.25
RXN
  Top 0.32: U2.2 20.88,43.06 20.24,42.43 L6.1
  Top 0.4: L6.1 20.25,42.37 L7.2 C5.1
RXP
  Top 0.32: U2.3 21.38,42.49 L6.2
  Top 0.4: C6.2 21.26,41.58 L6.2
SAM_XOSC
  Top 0.152: U1.15 18.25,50.88 16.5,49.12 R12.1
  Top 0.4: R12.1 R13.2 C18.1
SE800_LF_OUT
  Top 0.2: U11.2 16.84,62.55 R8.2
SE_GPIO0
  Top 0.152: U3.17 14.85,60.65 14.12,61.38 R2.2
SE_GPIO1
  Top 0.152: U3.16 15.25,61.12 14.25,62.12 R3.2
SE_MODE_PULL
  Top 0.152: U3.31 16.45,56.18 17.12,55.5 R4.1
SE_ON_OFF
  Top 0.152: U3.3 18.49,57.58 18.88,57.19 18.88,56.5 20.38,55 U1.6
SE_TCXO_CLK  (via drill 0.3)
  Top 0.152: U3.21 13.4,58.77 v12.88,58.25
  Top 0.2: C14.1 12.75,53.38 v12.88,53.5
  Bottom 0.2: v12.88,58.25 12.62,58 12.62,53.75 v12.88,53.5
SE_VBB
  Top 0.2: U3.6 19.75,58.77 L8.1 20.06,58.5
SE_VREG
  Top 0.2: U3.7 18.55,59.17 19.35,59.98 L8.2
SI_GPIO0  (via drill 0.3)
  Top 0.152: U2.9 23.88,46 24.25,46.38 R29.1 24.49,46.25 24.5,46.25 25,45.75 27,45.75 27.62,45.12 27.62,44 27.25,43.62 26.88,43.62 26.62,43.38 26.62,42.25 24.19,39.81 24.19,35.06 24.75,34.5 v24.75,34.38 | C46.2 21.5,29.12 22.38,29.12 23,29.75
  Top 0.2: v23.5,34 R22.2 23,31.62 U16.2 23,29.75
  Top 0.4: U19.4 21.38,27.8 C46.2
  Bottom 0.152: v23.5,34 23.88,34.38 v24.75,34.38
SI_GPIO1
  Top 0.152: 23.12,46.5 U2.10 22.88,46.97 U1.24
SI_GPIO2
  Top 0.152: U2.19 19.06,45 18.56,44.5 18.56,43.25 17.38,42.06 17.38,41.38 15.75,39.75 14.25,39.75 13.88,39.38 R31.1 13.62,39.24 U17.2
SI_GPIO3
  Top 0.152: U2.20 19.25,44.5 18.88,44.12 18.88,43.12 17.75,42 17.75,41.25 15.5,39 15.5,37 14.75,36.25 14.75,35.5 14.25,35 13.75,35 13.76,34.99 R32.1 13.62,34.99 U18.2
SI_MISO
  Top 0.152: U1.21 U2.13
SI_MOSI
  Top 0.152: U1.20 U2.14
SI_NIRQ
  Top 0.152: U1.23 U2.11
SI_NSEL
  Top 0.152: U1.19 U2.15
SI_SCLK
  Top 0.152: U1.22 U2.12
SI_SDN  (via drill 0.3)
  Top 0.152: 20.38,43.72 U2.1 20.38,43.75 v19.5,43.75 | v17.75,47.12 18.62,47.12 19.88,48.38 U1.18
  Bottom 0.152: v17.75,47.12 17.38,46.75 17.38,44 18,43.38 19.12,43.38 v19.5,43.75
SI_TX
  Top 0.32: U2.4 21.88,42.76 arc90 C0.2
  Top 0.4: LC.1 C0.2
SKY_OUT
  Top 0.2: C40.1 U20.11
SKY_V1
  Top 0.152: U20.4 19.5,12.38 16.94,14.94 16.94,23.44 18.12,24.62 R20.1
SKY_V1_1  (via drill 0.3)
  Top 0.152: R20.2 17.89,26.62 17.88,26.62 17.88,27.38 15.5,29.75 15.5,33 15.12,33.38 15.12,35.62 v15.38,35.88
  Top 0.2: U17.4 14.29,38.53 v14.88,39.12
  Bottom 0.2: v14.88,39.12 14.25,38.5 14.25,37 v15.38,35.88
SKY_V2
  Top 0.152: U20.5 19,12.38 16.62,14.75 16.62,24.36 R21.1
SKY_V2_1
  Top 0.152: R21.2 17.38,26.64 17.38,27.38 15.12,29.62 15.12,32.38 14.29,33.22 U18.4
SOLAR1  (via drill 0.3)
  Top 0.8: D1.ANODE 13.75,72.5 v13.75,72 v13.75,73
  pour Bottom: 12.5,73.5 19,73.5 19,71.5 12.5,71.5
SOLAR2  (via drill 0.3)
  Top 0.8: D2.ANODE 28.25,72.5 v28.25,72 v28.25,73
  pour Bottom: 23,71.5 23,73.5 29.5,73.5 29.5,71.5
SWDCLK  (via drill 0.3)
  Top 0.152: U1.31 24.12,53.38 26.38,55.62 28.75,55.62 29.62,54.75 35.75,54.75 36.12,54.38 36.12,53.62 37,52.75 v37.38,52.75 | JTAG1.4 37.25,52.77 36.98,52.77
  Top 0.2: v37.38,52.75 37.35,52.77 37.25,52.77 | v38.62,52.75 38.6,52.77 JTAG1.4
SWDIO  (via drill 0.3)
  Top 0.152: 37.88,54.19 JTAG1.2 | 23.88,53.88 U1.32 24.12,53.88 26.25,56 31.75,56 32.62,55.12 35.88,55.12 37,54 v37.38,54
  Top 0.2: v38.62,54 38.59,54.04 JTAG1.2 | 37.88,54.19 37.88,54.12 37.75,54 v37.38,54
TCXO_OUT
  Top 0.2: C14.2 12.75,47.62 14.12,46.25 C13.1 | 16.99,45.62 17.12,45.75
  Top 0.4: U5.3 17.12,45.63 17.12,45.75 C13.1 C18.2
TCXO_REG_IN
  Top 0.4: C23.1 FB2.1 12.96,44.24 U6.1
TCXO_REG_NR
  Top 0.4: U6.4 15.38,41.31 C12.1
TCXO_VDD
  Top 0.4: U6.5 16.75,43.19 C24.1 16.75,43.67 U5.4
TX
  Top 0.4: C44.1 20.38,31.12 | 20.38,31.12 20.38,31.62 L5.1 | 20.38,31.12 C1.1
TX_1
  Top 0.4: U19.5 C44.2
V_BUS  (via drill 0.3)
  Top 0.152: R26.2 23,64.88 22.5,65.38 22.5,66.88 22.25,67.12 22.25,70.38 22.38,70.5
  Top 0.2: D3.CATHODE 19.15,70.88 12.38,70.88 11.88,71.38 8.8,71.38 JP2.1 | 28.5,68.88 v28.62,68.75 | v28.25,27.88 26.88,27.88 26.37,27.37 C52.1 26.2,27.42 U15.4
  Top 0.4: D3.CATHODE 19.48,70.5 19.38,70.5 | U9.5 28.5,68.75 v28.62,68.75 | R30.1 28.5,69.5 28.5,68.88 | D5.CATHODE 26.23,66.28 v27.12,65.38 | v29.38,43.12 29.38,43.83 Q2.2 29.3,44 29.38,44 29.38,45.01 R10.1
  Top 0.6: 19.25,70.5 19.38,70.5 22.38,70.5 24.23,70.5 | v28.62,68.75 v27.88,68.75 | 28.02,68.75 v27.88,68.75 | 25.24,69.49 25.72,69.01 R6.1 C11.1 27.62,69.01 v27.88,68.75 | 25.24,69.49 24.23,70.5 | 24.23,70.5 24.23,70.75 | 24.23,70.75 D2.CATHODE | Q3.2 25.21,69.49 25.24,69.49 | DZ1.C 24.61,70.75 24.23,70.75 | D1.CATHODE 17.77,72.25 D3.CATHODE
  Bottom 0.4: v28.25,27.88 29.5,29.12 29.5,43.12 | 29.5,43.12 29.5,65.38 | 29.5,65.38 29.5,67.88 v28.62,68.75 v27.88,68.75 | v27.12,65.38 29.5,65.38 | v29.38,43.12 29.5,43.12
V_BUS_SENSE
  Top 0.152: R26.1 23.13,58.87 | 23,58.75 R27.2 | R27.2 23,57.25 21.38,55.62 U1.4 | R27.2
  Top 0.2: R26.1 23.01,58.75 23,58.75
V_GG
  Top 0.152: U14.5 28.09,24.29 27.62,24.75 26.12,24.75 25.5,24.12 C26.1
  Top 0.4: R19.2 C26.1
V_SKY
  Top 0.152: U20.6 18.5,12.38 16.31,14.56 16.31,25.31 16.62,25.62 18.62,25.62 19.25,26.25 22.25,26.25 22.63,26.63 C35.1
  Top 0.2: 24.12,27.51 U15.5 24.25,27.42 24.25,27.38 | 24.25,27.25 24.25,27.38 | 24.25,27.38 23.51,26.63 C35.1
VDD_CORE
  Top 0.2: U1.29 24.38,52.38 24.62,52.13 C16.1
WDI
  Top 0.152: U1.27 25.25,51.38 25.44,51.56 26.06,51.56 26.32,51.83 26.32,53 | 26.32,53 26.32,53.79 R17.2 | U7.4 26.38,52.95 26.32,53
WDI!RESET
  Top 0.152: U8.2 29.25,48.5 29.62,48.88 29.62,50 | 29.62,50 29.62,50.75 29.32,51.05 U7.1 | R16.2 29.62,50
  Top 0.2: 29.07,51.05 U7.1

### Text on the board
tStop: Connect to / disable buck | BRISTOL | UNIVERSITY | V0.99 | + | + | Solar Inputs | - | Battery | BSS84 | x2 | TPS62243 | LTC4070 | NX2301P | SiT1552 | 680nH | SE880 | SiT1552 | Si4461 | TXCO | TPS73118 | ADP1614 | NOT gate | x2 | 4.7µH | MBR0520L | AS213-92 | TPS71533 | x2 | PD84001 | SKY13373 | Richard Meadows 2016 | 144MHz / 434MHz | RF